# Altium project Dashcam_V2.0B.PrjPcb (part 4 of 9)

## Sheet LPDDR4.SchDoc: LPDDR4
size A2; DrawnBy: UKAYACIK; Engineer: UKAYACIK; DocumentNumber: 10; Revision: A; SheetNumber: 12; SheetTotal: 21
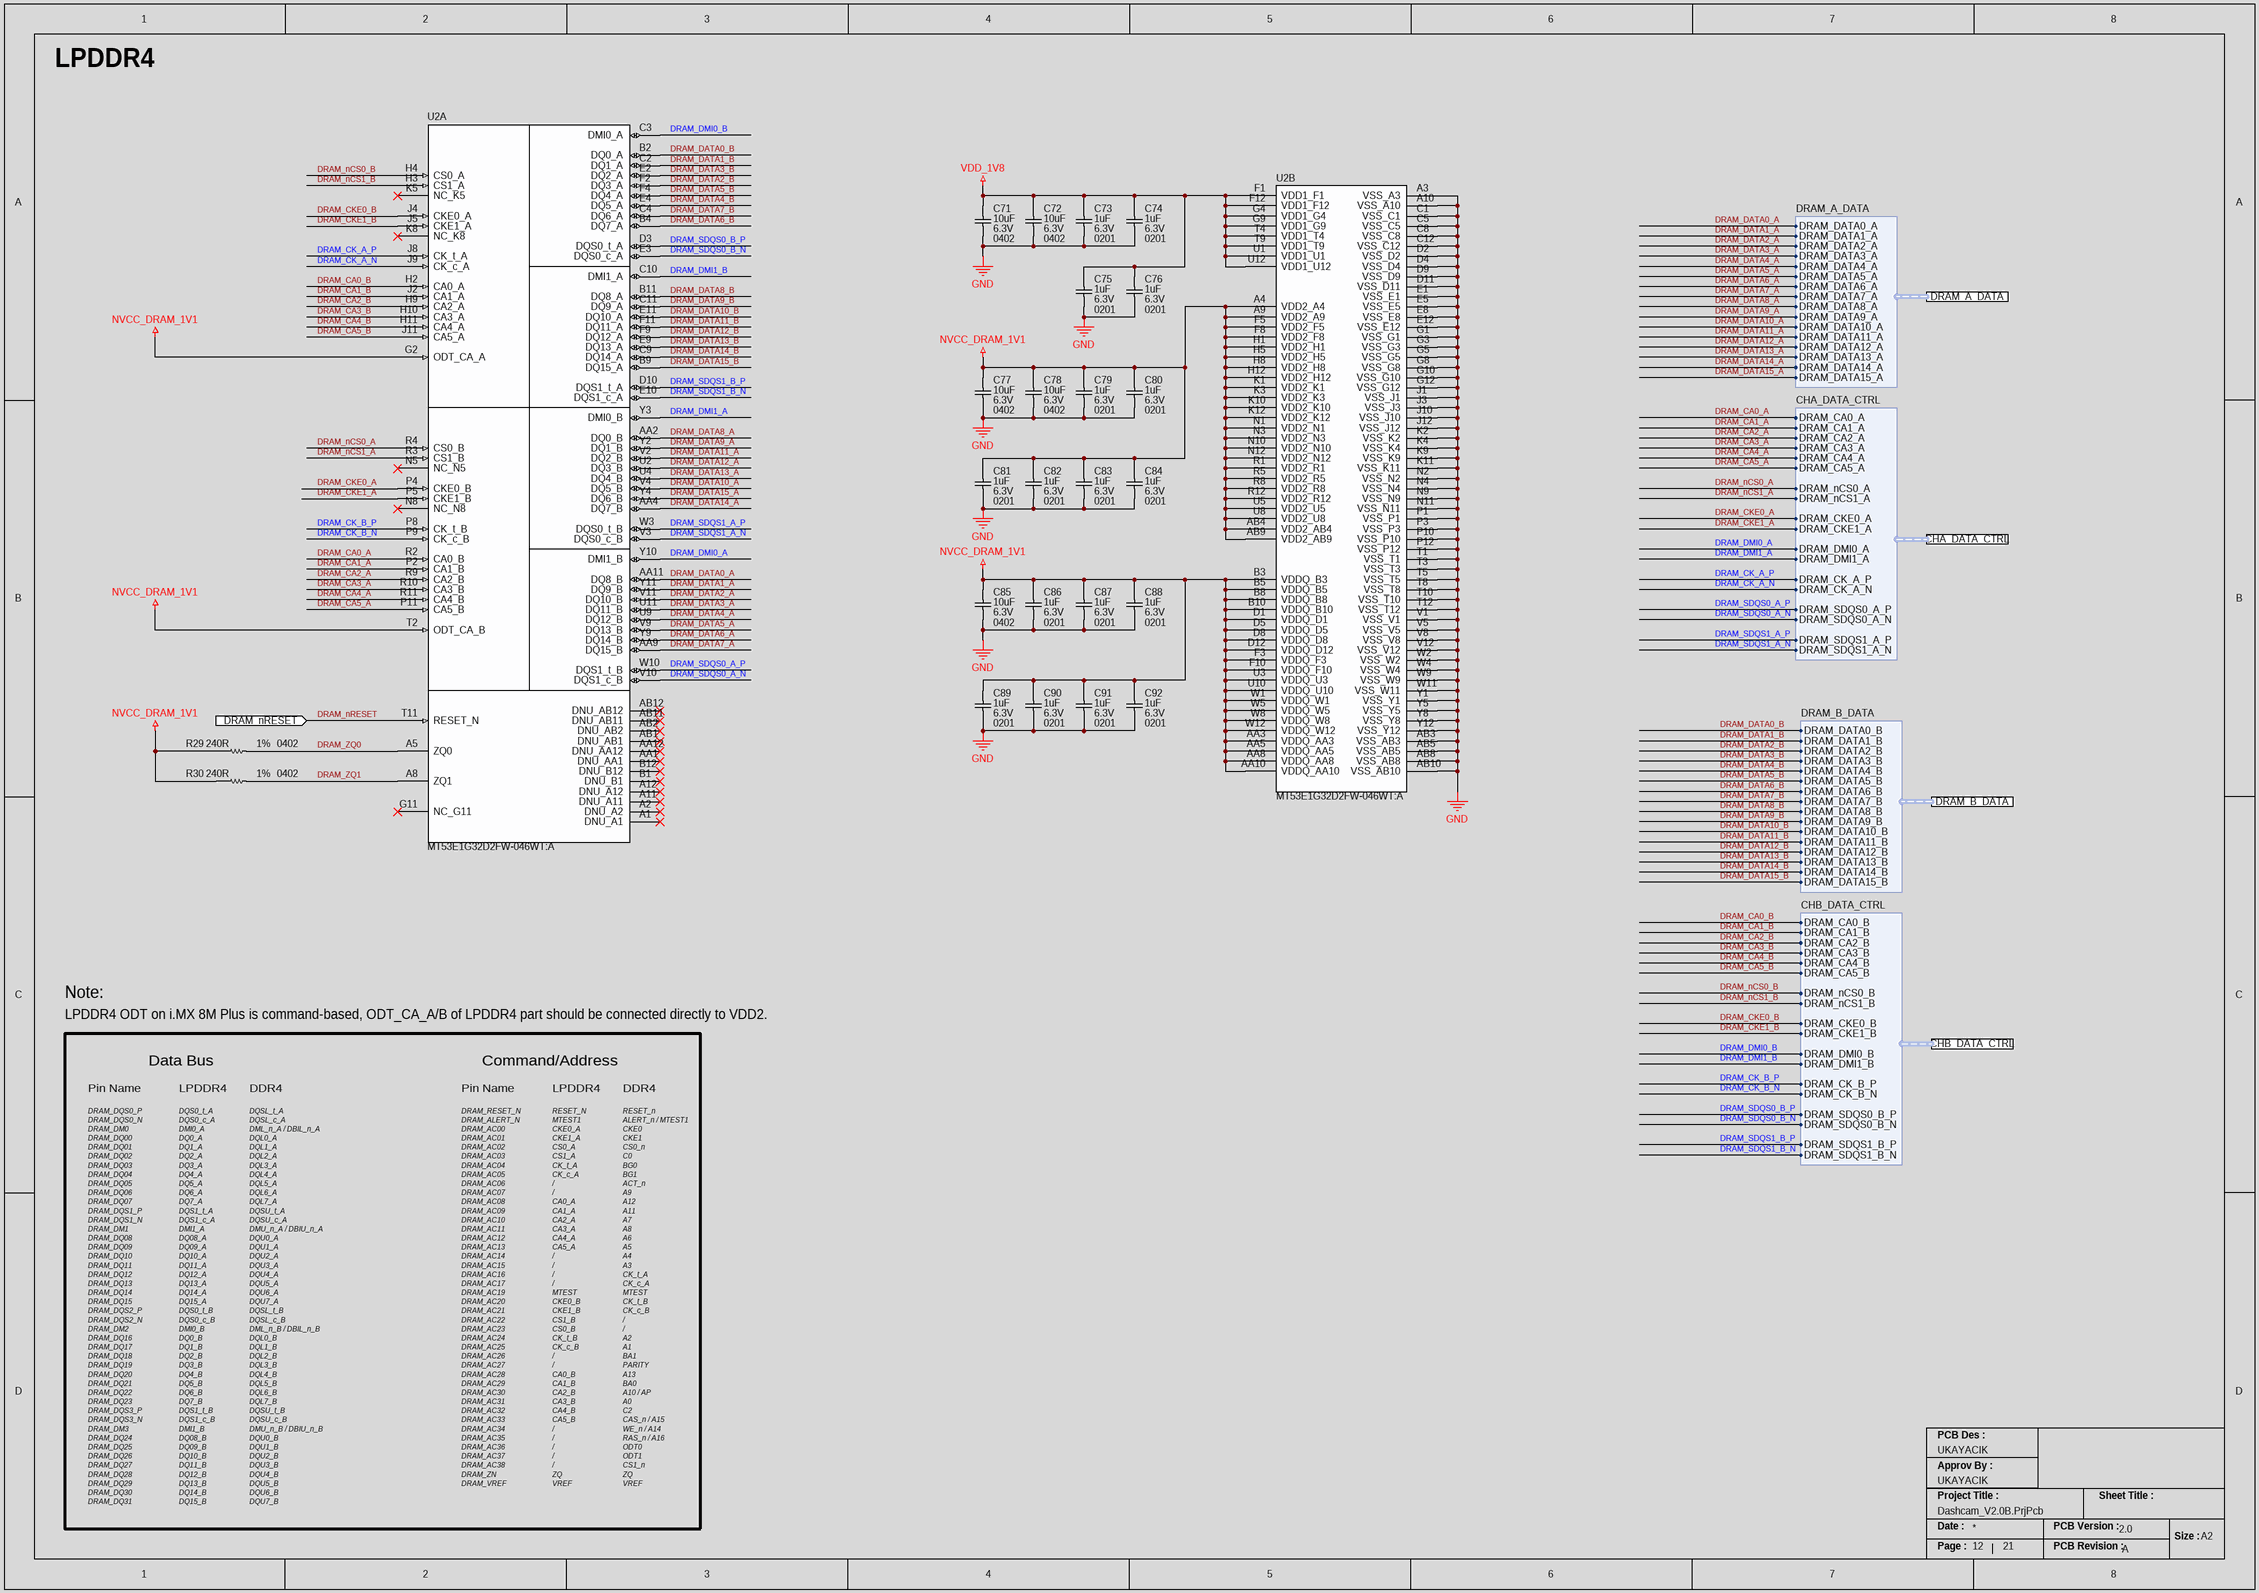
[diagram p12: LPDDR4.SchDoc]

### Parts
C71  Case/Package: 0402  Capacitance: 10uF  Voltage Rating: 6.3V  [CAP_0402_CAPC1005X05N]  (hidden comment: CL05A106MQ5NUNC)
C72  Case/Package: 0402  Capacitance: 10uF  Voltage Rating: 6.3V  [CAP_0402_CAPC1005X05N]  (hidden comment: CL05A106MQ5NUNC)
C73  Voltage Rating (DC): 6.3V  Capacitance: 1uF  Case/Package: 0201  [CAP_0201_CAPC0603X03N]  (hidden comment: 02016D105MAT2A)
C74  Voltage Rating (DC): 6.3V  Capacitance: 1uF  Case/Package: 0201  [CAP_0201_CAPC0603X03N]  (hidden comment: 02016D105MAT2A)
C75  Voltage Rating (DC): 6.3V  Capacitance: 1uF  Case/Package: 0201  [CAP_0201_CAPC0603X03N]  (hidden comment: 02016D105MAT2A)
C76  Voltage Rating (DC): 6.3V  Capacitance: 1uF  Case/Package: 0201  [CAP_0201_CAPC0603X03N]  (hidden comment: 02016D105MAT2A)
C77  Case/Package: 0402  Capacitance: 10uF  Voltage Rating: 6.3V  [CAP_0402_CAPC1005X05N]  (hidden comment: CL05A106MQ5NUNC)
C78  Case/Package: 0402  Capacitance: 10uF  Voltage Rating: 6.3V  [CAP_0402_CAPC1005X05N]  (hidden comment: CL05A106MQ5NUNC)
C79  Voltage Rating (DC): 6.3V  Capacitance: 1uF  Case/Package: 0201  [CAP_0201_CAPC0603X03N]  (hidden comment: 02016D105MAT2A)
C80  Voltage Rating (DC): 6.3V  Capacitance: 1uF  Case/Package: 0201  [CAP_0201_CAPC0603X03N]  (hidden comment: 02016D105MAT2A)
C81  Voltage Rating (DC): 6.3V  Capacitance: 1uF  Case/Package: 0201  [CAP_0201_CAPC0603X03N]  (hidden comment: 02016D105MAT2A)
C82  Voltage Rating (DC): 6.3V  Capacitance: 1uF  Case/Package: 0201  [CAP_0201_CAPC0603X03N]  (hidden comment: 02016D105MAT2A)
C83  Voltage Rating (DC): 6.3V  Capacitance: 1uF  Case/Package: 0201  [CAP_0201_CAPC0603X03N]  (hidden comment: 02016D105MAT2A)
C84  Voltage Rating (DC): 6.3V  Capacitance: 1uF  Case/Package: 0201  [CAP_0201_CAPC0603X03N]  (hidden comment: 02016D105MAT2A)
C85  Case/Package: 0402  Capacitance: 10uF  Voltage Rating: 6.3V  [CAP_0402_CAPC1005X05N]  (hidden comment: CL05A106MQ5NUNC)
C86  Voltage Rating (DC): 6.3V  Capacitance: 1uF  Case/Package: 0201  [CAP_0201_CAPC0603X03N]  (hidden comment: 02016D105MAT2A)
C87  Voltage Rating (DC): 6.3V  Capacitance: 1uF  Case/Package: 0201  [CAP_0201_CAPC0603X03N]  (hidden comment: 02016D105MAT2A)
C88  Voltage Rating (DC): 6.3V  Capacitance: 1uF  Case/Package: 0201  [CAP_0201_CAPC0603X03N]  (hidden comment: 02016D105MAT2A)
C89  Voltage Rating (DC): 6.3V  Capacitance: 1uF  Case/Package: 0201  [CAP_0201_CAPC0603X03N]  (hidden comment: 02016D105MAT2A)
C90  Voltage Rating (DC): 6.3V  Capacitance: 1uF  Case/Package: 0201  [CAP_0201_CAPC0603X03N]  (hidden comment: 02016D105MAT2A)
C91  Voltage Rating (DC): 6.3V  Capacitance: 1uF  Case/Package: 0201  [CAP_0201_CAPC0603X03N]  (hidden comment: 02016D105MAT2A)
C92  Voltage Rating (DC): 6.3V  Capacitance: 1uF  Case/Package: 0201  [CAP_0201_CAPC0603X03N]  (hidden comment: 02016D105MAT2A)
R29  Tolerance: 1%  Resistance: 240R  Case/Package: 0402  [RES_0402_RESC1005X04N]  (hidden comment: RC0402FR-07240RL)
R30  Tolerance: 1%  Resistance: 240R  Case/Package: 0402  [RES_0402_RESC1005X04N]  (hidden comment: RC0402FR-07240RL)
U2  MT53E1G32D2FW-046WT:A  [IC_DRAM_BGA200_0P65X0P8_10P1X14P6]  (parts A,B of 2)

### Ports
CHA_DATA_CTRL (harness CHA_DATA_CTRL), CHB_DATA_CTRL (harness CHB_DATA_CTRL), DRAM_A_DATA (harness DRAM_A_DATA), DRAM_B_DATA (harness DRAM_B_DATA), DRAM_nRESET (in)

### Harnesses
DRAM_A_DATA: DRAM_DATA0_A, DRAM_DATA1_A, DRAM_DATA2_A, DRAM_DATA3_A, DRAM_DATA4_A, DRAM_DATA5_A, DRAM_DATA6_A, DRAM_DATA7_A, DRAM_DATA8_A, DRAM_DATA9_A, DRAM_DATA10_A, DRAM_DATA11_A, DRAM_DATA12_A, DRAM_DATA13_A, DRAM_DATA14_A, DRAM_DATA15_A
CHA_DATA_CTRL: DRAM_CA0_A, DRAM_CA1_A, DRAM_CA2_A, DRAM_CA3_A, DRAM_CA4_A, DRAM_CA5_A, DRAM_nCS0_A, DRAM_nCS1_A, DRAM_CKE0_A, DRAM_CKE1_A, DRAM_CK_A_P, DRAM_CK_A_N, DRAM_DMI0_A, DRAM_DMI1_A, DRAM_SDQS0_A_P, DRAM_SDQS0_A_N, DRAM_SDQS1_A_P, DRAM_SDQS1_A_N
DRAM_B_DATA: DRAM_DATA0_B, DRAM_DATA1_B, DRAM_DATA2_B, DRAM_DATA3_B, DRAM_DATA4_B, DRAM_DATA5_B, DRAM_DATA6_B, DRAM_DATA7_B, DRAM_DATA8_B, DRAM_DATA9_B, DRAM_DATA10_B, DRAM_DATA11_B, DRAM_DATA12_B, DRAM_DATA13_B, DRAM_DATA14_B, DRAM_DATA15_B
CHB_DATA_CTRL: DRAM_CA0_B, DRAM_CA1_B, DRAM_CA2_B, DRAM_CA3_B, DRAM_CA4_B, DRAM_CA5_B, DRAM_nCS0_B, DRAM_nCS1_B, DRAM_CKE0_B, DRAM_CKE1_B, DRAM_CK_B_P, DRAM_CK_B_N, DRAM_DMI0_B, DRAM_DMI1_B, DRAM_SDQS0_B_P, DRAM_SDQS0_B_N, DRAM_SDQS1_B_P, DRAM_SDQS1_B_N

### Nets
GND: C71.1 C72.1 C73.1 C74.1 C75.1 C76.1 C77.1 C78.1 C79.1 C80.1 C81.1 C82.1 C83.1 C84.1 C85.1 C86.1 C87.1 C88.1 C89.1 C90.1 C91.1 C92.1 U2.A3(VSS_A3) U2.A10(VSS_A10) U2.AB3(VSS_AB3) U2.AB5(VSS_AB5) U2.AB8(VSS_AB8) U2.AB10(VSS_AB10) U2.C1(VSS_C1) U2.C5(VSS_C5) U2.C8(VSS_C8) U2.C12(VSS_C12) U2.D2(VSS_D2) U2.D4(VSS_D4) U2.D9(VSS_D9) U2.D11(VSS_D11) U2.E1(VSS_E1) U2.E5(VSS_E5) U2.E8(VSS_E8) U2.E12(VSS_E12) U2.G1(VSS_G1) U2.G3(VSS_G3) U2.G5(VSS_G5) U2.G8(VSS_G8) U2.G10(VSS_G10) U2.G12(VSS_G12) U2.J1(VSS_J1) U2.J3(VSS_J3) U2.J10(VSS_J10) U2.J12(VSS_J12) U2.K2(VSS_K2) U2.K4(VSS_K4) U2.K9(VSS_K9) U2.K11(VSS_K11) U2.N2(VSS_N2) U2.N4(VSS_N4) U2.N9(VSS_N9) U2.N11(VSS_N11) U2.P1(VSS_P1) U2.P3(VSS_P3) U2.P10(VSS_P10) U2.P12(VSS_P12) U2.T1(VSS_T1) U2.T3(VSS_T3) U2.T5(VSS_T5) U2.T8(VSS_T8) U2.T10(VSS_T10) U2.T12(VSS_T12) U2.V1(VSS_V1) U2.V5(VSS_V5) U2.V8(VSS_V8) U2.V12(VSS_V12) U2.W2(VSS_W2) U2.W4(VSS_W4) U2.W9(VSS_W9) U2.W11(VSS_W11) U2.Y1(VSS_Y1) U2.Y5(VSS_Y5) U2.Y8(VSS_Y8) U2.Y12(VSS_Y12)
NVCC_DRAM_1V1: C77.2 C78.2 C79.2 C80.2 C81.2 C82.2 C83.2 C84.2 C85.2 C86.2 C87.2 C88.2 C89.2 C90.2 C91.2 C92.2 R29.1 R30.1 U2.A4(VDD2_A4) U2.A9(VDD2_A9) U2.AA3(VDDQ_AA3) U2.AA5(VDDQ_AA5) U2.AA8(VDDQ_AA8) U2.AA10(VDDQ_AA10) U2.AB4(VDD2_AB4) U2.AB9(VDD2_AB9) U2.B3(VDDQ_B3) U2.B5(VDDQ_B5) U2.B8(VDDQ_B8) U2.B10(VDDQ_B10) U2.D1(VDDQ_D1) U2.D5(VDDQ_D5) U2.D8(VDDQ_D8) U2.D12(VDDQ_D12) U2.F3(VDDQ_F3) U2.F5(VDD2_F5) U2.F8(VDD2_F8) U2.F10(VDDQ_F10) U2.G2(ODT_CA_A) U2.H1(VDD2_H1) U2.H5(VDD2_H5) U2.H8(VDD2_H8) U2.H12(VDD2_H12) U2.K1(VDD2_K1) U2.K3(VDD2_K3) U2.K10(VDD2_K10) U2.K12(VDD2_K12) U2.N1(VDD2_N1) U2.N3(VDD2_N3) U2.N10(VDD2_N10) U2.N12(VDD2_N12) U2.R1(VDD2_R1) U2.R5(VDD2_R5) U2.R8(VDD2_R8) U2.R12(VDD2_R12) U2.T2(ODT_CA_B) U2.U3(VDDQ_U3) U2.U5(VDD2_U5) U2.U8(VDD2_U8) U2.U10(VDDQ_U10) U2.W1(VDDQ_W1) U2.W5(VDDQ_W5) U2.W8(VDDQ_W8) U2.W12(VDDQ_W12)
VDD_1V8: C71.2 C72.2 C73.2 C74.2 C75.2 C76.2 U2.F1(VDD1_F1) U2.F12(VDD1_F12) U2.G4(VDD1_G4) U2.G9(VDD1_G9) U2.T4(VDD1_T4) U2.T9(VDD1_T9) U2.U1(VDD1_U1) U2.U12(VDD1_U12)
DRAM_CA0_A: U2.R2(CA0_B) ; port CHA_DATA_CTRL.DRAM_CA0_A
DRAM_CA0_B: U2.H2(CA0_A) ; port CHB_DATA_CTRL.DRAM_CA0_B
DRAM_CA1_A: U2.P2(CA1_B) ; port CHA_DATA_CTRL.DRAM_CA1_A
DRAM_CA1_B: U2.J2(CA1_A) ; port CHB_DATA_CTRL.DRAM_CA1_B
DRAM_CA2_A: U2.R9(CA2_B) ; port CHA_DATA_CTRL.DRAM_CA2_A
DRAM_CA2_B: U2.H9(CA2_A) ; port CHB_DATA_CTRL.DRAM_CA2_B
DRAM_CA3_A: U2.R10(CA3_B) ; port CHA_DATA_CTRL.DRAM_CA3_A
DRAM_CA3_B: U2.H10(CA3_A) ; port CHB_DATA_CTRL.DRAM_CA3_B
DRAM_CA4_A: U2.R11(CA4_B) ; port CHA_DATA_CTRL.DRAM_CA4_A
DRAM_CA4_B: U2.H11(CA4_A) ; port CHB_DATA_CTRL.DRAM_CA4_B
DRAM_CA5_A: U2.P11(CA5_B) ; port CHA_DATA_CTRL.DRAM_CA5_A
DRAM_CA5_B: U2.J11(CA5_A) ; port CHB_DATA_CTRL.DRAM_CA5_B
DRAM_CK_A_N: U2.J9(CK_c_A) ; port CHA_DATA_CTRL.DRAM_CK_A_N
DRAM_CK_A_P: U2.J8(CK_t_A) ; port CHA_DATA_CTRL.DRAM_CK_A_P
DRAM_CK_B_N: U2.P9(CK_c_B) ; port CHB_DATA_CTRL.DRAM_CK_B_N
DRAM_CK_B_P: U2.P8(CK_t_B) ; port CHB_DATA_CTRL.DRAM_CK_B_P
DRAM_CKE0_A: U2.P4(CKE0_B) ; port CHA_DATA_CTRL.DRAM_CKE0_A
DRAM_CKE0_B: U2.J4(CKE0_A) ; port CHB_DATA_CTRL.DRAM_CKE0_B
DRAM_CKE1_A: U2.P5(CKE1_B) ; port CHA_DATA_CTRL.DRAM_CKE1_A
DRAM_CKE1_B: U2.J5(CKE1_A) ; port CHB_DATA_CTRL.DRAM_CKE1_B
DRAM_DATA0_A: U2.AA11(DQ8_B) ; port DRAM_A_DATA.DRAM_DATA0_A
DRAM_DATA0_B: U2.B2(DQ0_A) ; port DRAM_B_DATA.DRAM_DATA0_B
DRAM_DATA1_A: U2.Y11(DQ9_B) ; port DRAM_A_DATA.DRAM_DATA1_A
DRAM_DATA1_B: U2.C2(DQ1_A) ; port DRAM_B_DATA.DRAM_DATA1_B
DRAM_DATA2_A: U2.V11(DQ10_B) ; port DRAM_A_DATA.DRAM_DATA2_A
DRAM_DATA2_B: U2.F2(DQ3_A) ; port DRAM_B_DATA.DRAM_DATA2_B
DRAM_DATA3_A: U2.U11(DQ11_B) ; port DRAM_A_DATA.DRAM_DATA3_A
DRAM_DATA3_B: U2.E2(DQ2_A) ; port DRAM_B_DATA.DRAM_DATA3_B
DRAM_DATA4_A: U2.U9(DQ12_B) ; port DRAM_A_DATA.DRAM_DATA4_A
DRAM_DATA4_B: U2.E4(DQ5_A) ; port DRAM_B_DATA.DRAM_DATA4_B
DRAM_DATA5_A: U2.V9(DQ13_B) ; port DRAM_A_DATA.DRAM_DATA5_A
DRAM_DATA5_B: U2.F4(DQ4_A) ; port DRAM_B_DATA.DRAM_DATA5_B
DRAM_DATA6_A: U2.Y9(DQ14_B) ; port DRAM_A_DATA.DRAM_DATA6_A
DRAM_DATA6_B: U2.B4(DQ7_A) ; port DRAM_B_DATA.DRAM_DATA6_B
DRAM_DATA7_A: U2.AA9(DQ15_B) ; port DRAM_A_DATA.DRAM_DATA7_A
DRAM_DATA7_B: U2.C4(DQ6_A) ; port DRAM_B_DATA.DRAM_DATA7_B
DRAM_DATA8_A: U2.AA2(DQ0_B) ; port DRAM_A_DATA.DRAM_DATA8_A
DRAM_DATA8_B: U2.B11(DQ8_A) ; port DRAM_B_DATA.DRAM_DATA8_B
DRAM_DATA9_A: U2.Y2(DQ1_B) ; port DRAM_A_DATA.DRAM_DATA9_A
DRAM_DATA9_B: U2.C11(DQ9_A) ; port DRAM_B_DATA.DRAM_DATA9_B
DRAM_DATA10_A: U2.V4(DQ5_B) ; port DRAM_A_DATA.DRAM_DATA10_A
DRAM_DATA10_B: U2.E11(DQ10_A) ; port DRAM_B_DATA.DRAM_DATA10_B
DRAM_DATA11_A: U2.V2(DQ2_B) ; port DRAM_A_DATA.DRAM_DATA11_A
DRAM_DATA11_B: U2.F11(DQ11_A) ; port DRAM_B_DATA.DRAM_DATA11_B
DRAM_DATA12_A: U2.U2(DQ3_B) ; port DRAM_A_DATA.DRAM_DATA12_A
DRAM_DATA12_B: U2.F9(DQ12_A) ; port DRAM_B_DATA.DRAM_DATA12_B
DRAM_DATA13_A: U2.U4(DQ4_B) ; port DRAM_A_DATA.DRAM_DATA13_A
DRAM_DATA13_B: U2.E9(DQ13_A) ; port DRAM_B_DATA.DRAM_DATA13_B
DRAM_DATA14_A: U2.AA4(DQ7_B) ; port DRAM_A_DATA.DRAM_DATA14_A
DRAM_DATA14_B: U2.C9(DQ14_A) ; port DRAM_B_DATA.DRAM_DATA14_B
DRAM_DATA15_A: U2.Y4(DQ6_B) ; port DRAM_A_DATA.DRAM_DATA15_A
DRAM_DATA15_B: U2.B9(DQ15_A) ; port DRAM_B_DATA.DRAM_DATA15_B
DRAM_DMI0_A: U2.Y10(DMI1_B) ; port CHA_DATA_CTRL.DRAM_DMI0_A
DRAM_DMI0_B: U2.C3(DMI0_A) ; port CHB_DATA_CTRL.DRAM_DMI0_B
DRAM_DMI1_A: U2.Y3(DMI0_B) ; port CHA_DATA_CTRL.DRAM_DMI1_A
DRAM_DMI1_B: U2.C10(DMI1_A) ; port CHB_DATA_CTRL.DRAM_DMI1_B
DRAM_nCS0_A: U2.R4(CS0_B) ; port CHA_DATA_CTRL.DRAM_nCS0_A
DRAM_nCS0_B: U2.H4(CS0_A) ; port CHB_DATA_CTRL.DRAM_nCS0_B
DRAM_nCS1_A: U2.R3(CS1_B) ; port CHA_DATA_CTRL.DRAM_nCS1_A
DRAM_nCS1_B: U2.H3(CS1_A) ; port CHB_DATA_CTRL.DRAM_nCS1_B
DRAM_nRESET: U2.T11(RESET_N) ; port DRAM_nRESET
DRAM_SDQS0_A_N: U2.V10(DQS1_c_B) ; port CHA_DATA_CTRL.DRAM_SDQS0_A_N
DRAM_SDQS0_A_P: U2.W10(DQS1_t_B) ; port CHA_DATA_CTRL.DRAM_SDQS0_A_P
DRAM_SDQS0_B_N: U2.E3(DQS0_c_A) ; port CHB_DATA_CTRL.DRAM_SDQS0_B_N
DRAM_SDQS0_B_P: U2.D3(DQS0_t_A) ; port CHB_DATA_CTRL.DRAM_SDQS0_B_P
DRAM_SDQS1_A_N: U2.V3(DQS0_c_B) ; port CHA_DATA_CTRL.DRAM_SDQS1_A_N
DRAM_SDQS1_A_P: U2.W3(DQS0_t_B) ; port CHA_DATA_CTRL.DRAM_SDQS1_A_P
DRAM_SDQS1_B_N: U2.E10(DQS1_c_A) ; port CHB_DATA_CTRL.DRAM_SDQS1_B_N
DRAM_SDQS1_B_P: U2.D10(DQS1_t_A) ; port CHB_DATA_CTRL.DRAM_SDQS1_B_P
DRAM_ZQ0: R29.2 U2.A5(ZQ0)
DRAM_ZQ1: R30.2 U2.A8(ZQ1)

Not connected (* = marked no-connect by the designer): U2 A1(DNU_A1)* A2(DNU_A2)* A11(DNU_A11)* A12(DNU_A12)* AA1(DNU_AA1)* AA12(DNU_AA12)* AB1(DNU_AB1)* AB2(DNU_AB2)* AB11(DNU_AB11)* AB12(DNU_AB12)* B1(DNU_B1)* B12(DNU_B12)* G11(NC_G11)* K5(NC_K5)* K8(NC_K8)* N5(NC_N5)* N8(NC_N8)*

### Notes on the sheet
- LPDDR4
- Note:
- LPDDR4 ODT on i.MX 8M Plus is command-based, ODT_CA_A/B of LPDDR4 part should be connected directly to VDD2.
- Pin Name
- Data Bus
- DDR4
- Command/Address
- DRAM_DQS0_P
  DRAM_DQS0_N
  DRAM_DM0
  DRAM_DQ00
  DRAM_DQ01
  DRAM_DQ02
  DRAM_DQ03
  DRAM_DQ04
  DRAM_DQ05
  DRAM_DQ06
  DRAM_DQ07
  DRAM_DQS1_P
  DRAM_DQS1_N
  DRAM_DM1
  DRAM_DQ08
  DRAM_DQ09
  DRAM_DQ10
  DRAM_DQ11
  DRAM_DQ12
  DRAM_DQ13
  DRAM_DQ14
  DRAM_DQ15
  DRAM_DQS2_P
  DRAM_DQS2_N
  DRAM_DM2
  DRAM_DQ16
  DRAM_DQ17
  DRAM_DQ18
  DRAM_DQ19
  DRAM_DQ20
  DRAM_DQ21
  DRAM_DQ22
  DRAM_DQ23
  DRAM_DQS3_P
  DRAM_DQS3_N
  DRAM_DM3
  DRAM_DQ24
  DRAM_DQ25
  DRAM_DQ26
  DRAM_DQ27
  DRAM_DQ28
  DRAM_DQ29
  DRAM_DQ30
  DRAM_DQ31
- DQS0_t_A
  DQS0_c_A
  DMI0_A
  DQ0_A
  DQ1_A
  DQ2_A
  DQ3_A
  DQ4_A
  DQ5_A
  DQ6_A
  DQ7_A
  DQS1_t_A
  DQS1_c_A
  DMI1_A
  DQ08_A
  DQ09_A
  DQ10_A
  DQ11_A
  DQ12_A
  DQ13_A
  DQ14_A
  DQ15_A
  DQS0_t_B
  DQS0_c_B
  DMI0_B
  DQ0_B
  DQ1_B
  DQ2_B
  DQ3_B
  DQ4_B
  DQ5_B
  DQ6_B
  DQ7_B
  DQS1_t_B
  DQS1_c_B
  DMI1_B
  DQ08_B
  DQ09_B
  DQ10_B
  DQ11_B
  DQ12_B
  DQ13_B
  DQ14_B
  DQ15_B
- DQSL_t_A
  DQSL_c_A
  DML_n_A / DBIL_n_A
  DQL0_A
  DQL1_A
  DQL2_A
  DQL3_A
  DQL4_A
  DQL5_A
  DQL6_A
  DQL7_A
  DQSU_t_A
  DQSU_c_A
  DMU_n_A / DBIU_n_A
  DQU0_A
  DQU1_A
  DQU2_A
  DQU3_A
  DQU4_A
  DQU5_A
  DQU6_A
  DQU7_A
  DQSL_t_B
  DQSL_c_B
  DML_n_B / DBIL_n_B
  DQL0_B
  DQL1_B
  DQL2_B
  DQL3_B
  DQL4_B
  DQL5_B
  DQL6_B
  DQL7_B
  DQSU_t_B
  DQSU_c_B
  DMU_n_B / DBIU_n_B
  DQU0_B
  DQU1_B
  DQU2_B
  DQU3_B
  DQU4_B
  DQU5_B
  DQU6_B
  DQU7_B
- DRAM_RESET_N
  DRAM_ALERT_N
  DRAM_AC00
  DRAM_AC01
  DRAM_AC02
  DRAM_AC03
  DRAM_AC04
  DRAM_AC05
  DRAM_AC06
  DRAM_AC07
  DRAM_AC08
  DRAM_AC09
  DRAM_AC10
  DRAM_AC11
  DRAM_AC12
  DRAM_AC13
  DRAM_AC14
  DRAM_AC15
  DRAM_AC16
  DRAM_AC17
  DRAM_AC19
  DRAM_AC20
  DRAM_AC21
  DRAM_AC22
  DRAM_AC23
  DRAM_AC24
  DRAM_AC25
  DRAM_AC26
  DRAM_AC27
  DRAM_AC28
  DRAM_AC29
  DRAM_AC30
  DRAM_AC31
  DRAM_AC32
  DRAM_AC33
  DRAM_AC34
  DRAM_AC35
  DRAM_AC36
  DRAM_AC37
  DRAM_AC38
  DRAM_ZN
  DRAM_VREF
- RESET_N
  MTEST1
  CKE0_A
  CKE1_A
  CS0_A
  CS1_A
  CK_t_A
  CK_c_A
  /
  /
  CA0_A
  CA1_A
  CA2_A
  CA3_A
  CA4_A
  CA5_A
  /
  /
  /
  /
  MTEST
  CKE0_B
  CKE1_B
  CS1_B
  CS0_B
  CK_t_B
  CK_c_B
  /
  /
  CA0_B
  CA1_B
  CA2_B
  CA3_B
  CA4_B
  CA5_B
  /
  /
  /
  /
  /
  ZQ
  VREF
- RESET_n
  ALERT_n / MTEST1
  CKE0
  CKE1
  CS0_n
  C0
  BG0
  BG1
  ACT_n
  A9
  A12
  A11
  A7
  A8
  A6
  A5
  A4
  A3
  CK_t_A
  CK_c_A
  MTEST
  CK_t_B
  CK_c_B
  /
  /
  A2
  A1
  BA1
  PARITY
  A13
  BA0
  A10 / AP
  A0
  C2
  CAS_n / A15
  WE_n / A14
  RAS_n / A16
  ODT0
  ODT1
  CS1_n
  ZQ
  VREF
- PCB Des :
- Approv By :
- Project Title :
- Sheet Title :
- Date :
- Page :
- PCB Version :
- PCB Revision :
- Size :
- A2

### Library data of the parts
C71 C72 C77 C78 C85 = CAP_10UF_6.3V_X5R_0402: as C1 on sheet CPU Power; Supplier 1: Digikey; Manufacturer Part Number: CL05A106MQ5NUNC; RoHS: Yes; Category: Ceramic Capacitors; Stock 1: 6097180; Pricing 1: 1=0.24, 10=0.153, 50=0.0968, 100=0.0774, 500=0.05588, 1000=0.04943, 2500=0.04728, 5000=0.04299 (USD); Mount: Surface Mount; Case Code (Metric): 1005; Case Code (Imperial): 0402; Min Operating Temperature: -55°C; Max Operating Temperature: 85°C; Packaging: Tape and Reel; Tolerance: 20%; Dielectric: X5R; Series: CL; Package Quantity: 1; Construction: Flat; Length: 1mm; Width: 0.02inch; Height: 0.5mm; Depth: 0.5mm; Thickness: 0.028inch; Radiation Hardening: No; RoHS Compliant: Yes; ComponentLink1URL: https://datasheet.ciiva.com/16437/cl05a106mq5nunc-16437356.pdf?src-supplier=Future+Electronics; ComponentLink1Description: https://datasheet.ciiva.com/16437/cl05a106mq5nunc-16437356.pdf?src-supplier=Future+Electronics; ComponentLink2URL: https://datasheet.ciiva.com/26877/getdatasheetpartid-355289-26877841.pdf?src-supplier=Verical; ComponentLink2Description: https://datasheet.ciiva.com/26877/getdatasheetpartid-355289-26877841.pdf?src-supplier=Verical; Supplier Part Number 1: 1276-1451-1-ND
C73-C76 C79-C84 C86-C92 = CAP_1UF_6.3V_X5R_0201: as C2 on sheet CPU Power; Supplier 1: Mouser; Manufacturer Part Number: 02016D105MAT2A; RoHS: Yes; Category: Ceramic Capacitors; Stock 1: 1026413; Pricing 1: 1=0.1, 10=0.028, 50=0.028, 100=0.014, 1000=0.008, 10000=0.006 (USD); Mount: Surface Mount; Number of Pins: 2; Case Code (Metric): 0603; Case Code (Imperial): 0201; Min Operating Temperature: -55°C; Max Operating Temperature: 85°C; Packaging: Cut Tape; Series: -; Voltage Rating: 6.3V; Package Quantity: 1; Length: 0.024inch; Width: 0.012inch; Thickness: 0.013inch; Depth: 0.3mm; Lead Free: Lead Free; RoHS Compliant: Yes; Reach SVHC Compliant: No; ComponentLink1URL: https://datasheet.ciiva.com/6265/cx5r-6265595.pdf?src-supplier=Digi-Key; ComponentLink1Description: https://datasheet.ciiva.com/6265/cx5r-6265595.pdf?src-supplier=Digi-Key; ComponentLink2URL: https://datasheet.ciiva.com/1123/1666675-1123122.pdf?src-supplier=Element14; ComponentLink2Description: https://datasheet.ciiva.com/1123/1666675-1123122.pdf?src-supplier=Element14; ComponentLink3URL: https://datasheet.ciiva.com/14891/cx5r-14891029.pdf?src-supplier=Digi-Key; ComponentLink3Description: https://datasheet.ciiva.com/14891/cx5r-14891029.pdf?src-supplier=Digi-Key; ComponentLink4URL: https://datasheet.ciiva.com/7614/cx5r-7614682.pdf?src-supplier=Digi-Key; ComponentLink4Description: https://datasheet.ciiva.com/7614/cx5r-7614682.pdf?src-supplier=Digi-Key; ComponentLink5URL: https://datasheet.ciiva.com/14891/cx5r-14891030.pdf?src-supplier=Digi-Key; ComponentLink5Description: https://datasheet.ciiva.com/14891/cx5r-14891030.pdf?src-supplier=Digi-Key; Supplier Part Number 1: 581-02016D105MAT2A; Dielectric: X5R
R29 R30 = RES_240R_1%_63mW_0402: SMD Chip Resistor, 240 Ohm, ± 1%, 63 mW, 0402 [1005 Metric], Thick Film, General Purpose; Manufacturer: Yageo; Power Rating: 63mW; Voltage Rating: 50V; Temperature Coefficient: 100ppm/°C; Supplier 1: Digi-Key; Manufacturer Part Number: RC0402FR-07240RL; RoHS: Yes; Category: Chip SMD Resistors; Stock 1: 1880273; Pricing 1: 1=0.1, 10=0.014, 50=0.0084, 100=0.007, 500=0.00464, 1000=0.00396, 5000=0.00282 (USD); Case Code (Metric): 1005; Case Code (Imperial): 0402; Size Code: 0402; Min Operating Temperature: -55°C; Max Operating Temperature: 155°C; Resistor Type: Thick Film; Packaging: Tape and Reel; Number of Terminations: 2; Termination: SMD/SMT; Max Power Dissipation: 63mW; Voltage Rating (DC): 50V; Features: Moisture Resistant; Series: RC; Construction: Rectangular; Resistance Tolerance: 1%; Length: 1mm; Depth: 0.5mm; RoHS Compliant: Yes; Military Standard: Not; Lead Free: Lead Free; Reach SVHC Compliant: Unknown; ComponentLink1URL: https://datasheet.ciiva.com/7849/1018594-7849915.pdf?src-supplier=Element14; ComponentLink1Description: https://datasheet.ciiva.com/7849/1018594-7849915.pdf?src-supplier=Element14; ComponentLink2URL: https://datasheet.ciiva.com/7849/1018594-7849916.pdf?src-supplier=Element14; ComponentLink2Description: https://datasheet.ciiva.com/7849/1018594-7849916.pdf?src-supplier=Element14; ComponentLink3URL: https://datasheet.ciiva.com/2519/pyu-r-int-thick-7-2519158.pdf?src-supplier=Digi-Key; ComponentLink3Description: https://datasheet.ciiva.com/2519/pyu-r-int-thick-7-2519158.pdf?src-supplier=Digi-Key; ComponentLink4URL: https://datasheet.ciiva.com/2519/pyu-r-int-thick-7-2519157.pdf?src-supplier=Digi-Key; ComponentLink4Description: https://datasheet.ciiva.com/2519/pyu-r-int-thick-7-2519157.pdf?src-supplier=Digi-Key; ComponentLink5URL: https://datasheet.ciiva.com/2519/pyu-r-int-thick-7-2519156.pdf?src-supplier=Digi-Key; ComponentLink5Description: https://datasheet.ciiva.com/2519/pyu-r-int-thick-7-2519156.pdf?src-supplier=Digi-Key; ComponentLink6URL: https://datasheet.ciiva.com/12669/pyu-rc0402-51-rohs-l-6-r-12669689.pdf?src-supplier=Mouser; ComponentLink6Description: https://datasheet.ciiva.com/12669/pyu-rc0402-51-rohs-l-6-r-12669689.pdf?src-supplier=Mouser; ComponentLink7URL: https://datasheet.ciiva.com/17419/pyu-rc0402-51-rohs-l-6-r-17419482.pdf?src-supplier=Future+Electronics; ComponentLink7Description: https://datasheet.ciiva.com/17419/pyu-rc0402-51-rohs-l-6-r-17419482.pdf?src-supplier=Future+Electronics; Supplier Part Number 1: 311-240LRCT-ND
U2 = IC_DRAM_32G_MT53E1G32D2FW-046WT:A: LPDDR4 32G 1GX32 FBGA DDP; Manufacturer: Micron Technology; Supplier 1: Digikey; Manufacturer Part Number: MT53E1G32D2FW-046WT:A; RoHS: No; Stock 1: 1349; Pricing 1: 1=26.73, 10=24.892, 25=24.6252, 50=24.0178, 100=21.0842, 250=20.37296, 500=19.82474 (USD); Supplier Part Number 1: 557-MT53E1G32D2FW-046WT:A-ND

## Sheet eMMC FLASH.SchDoc: eMMC
size A3; DrawnBy: UKAYACIK; Engineer: UKAYACIK; DocumentNumber: 11; Revision: A; SheetNumber: 13; SheetTotal: 21
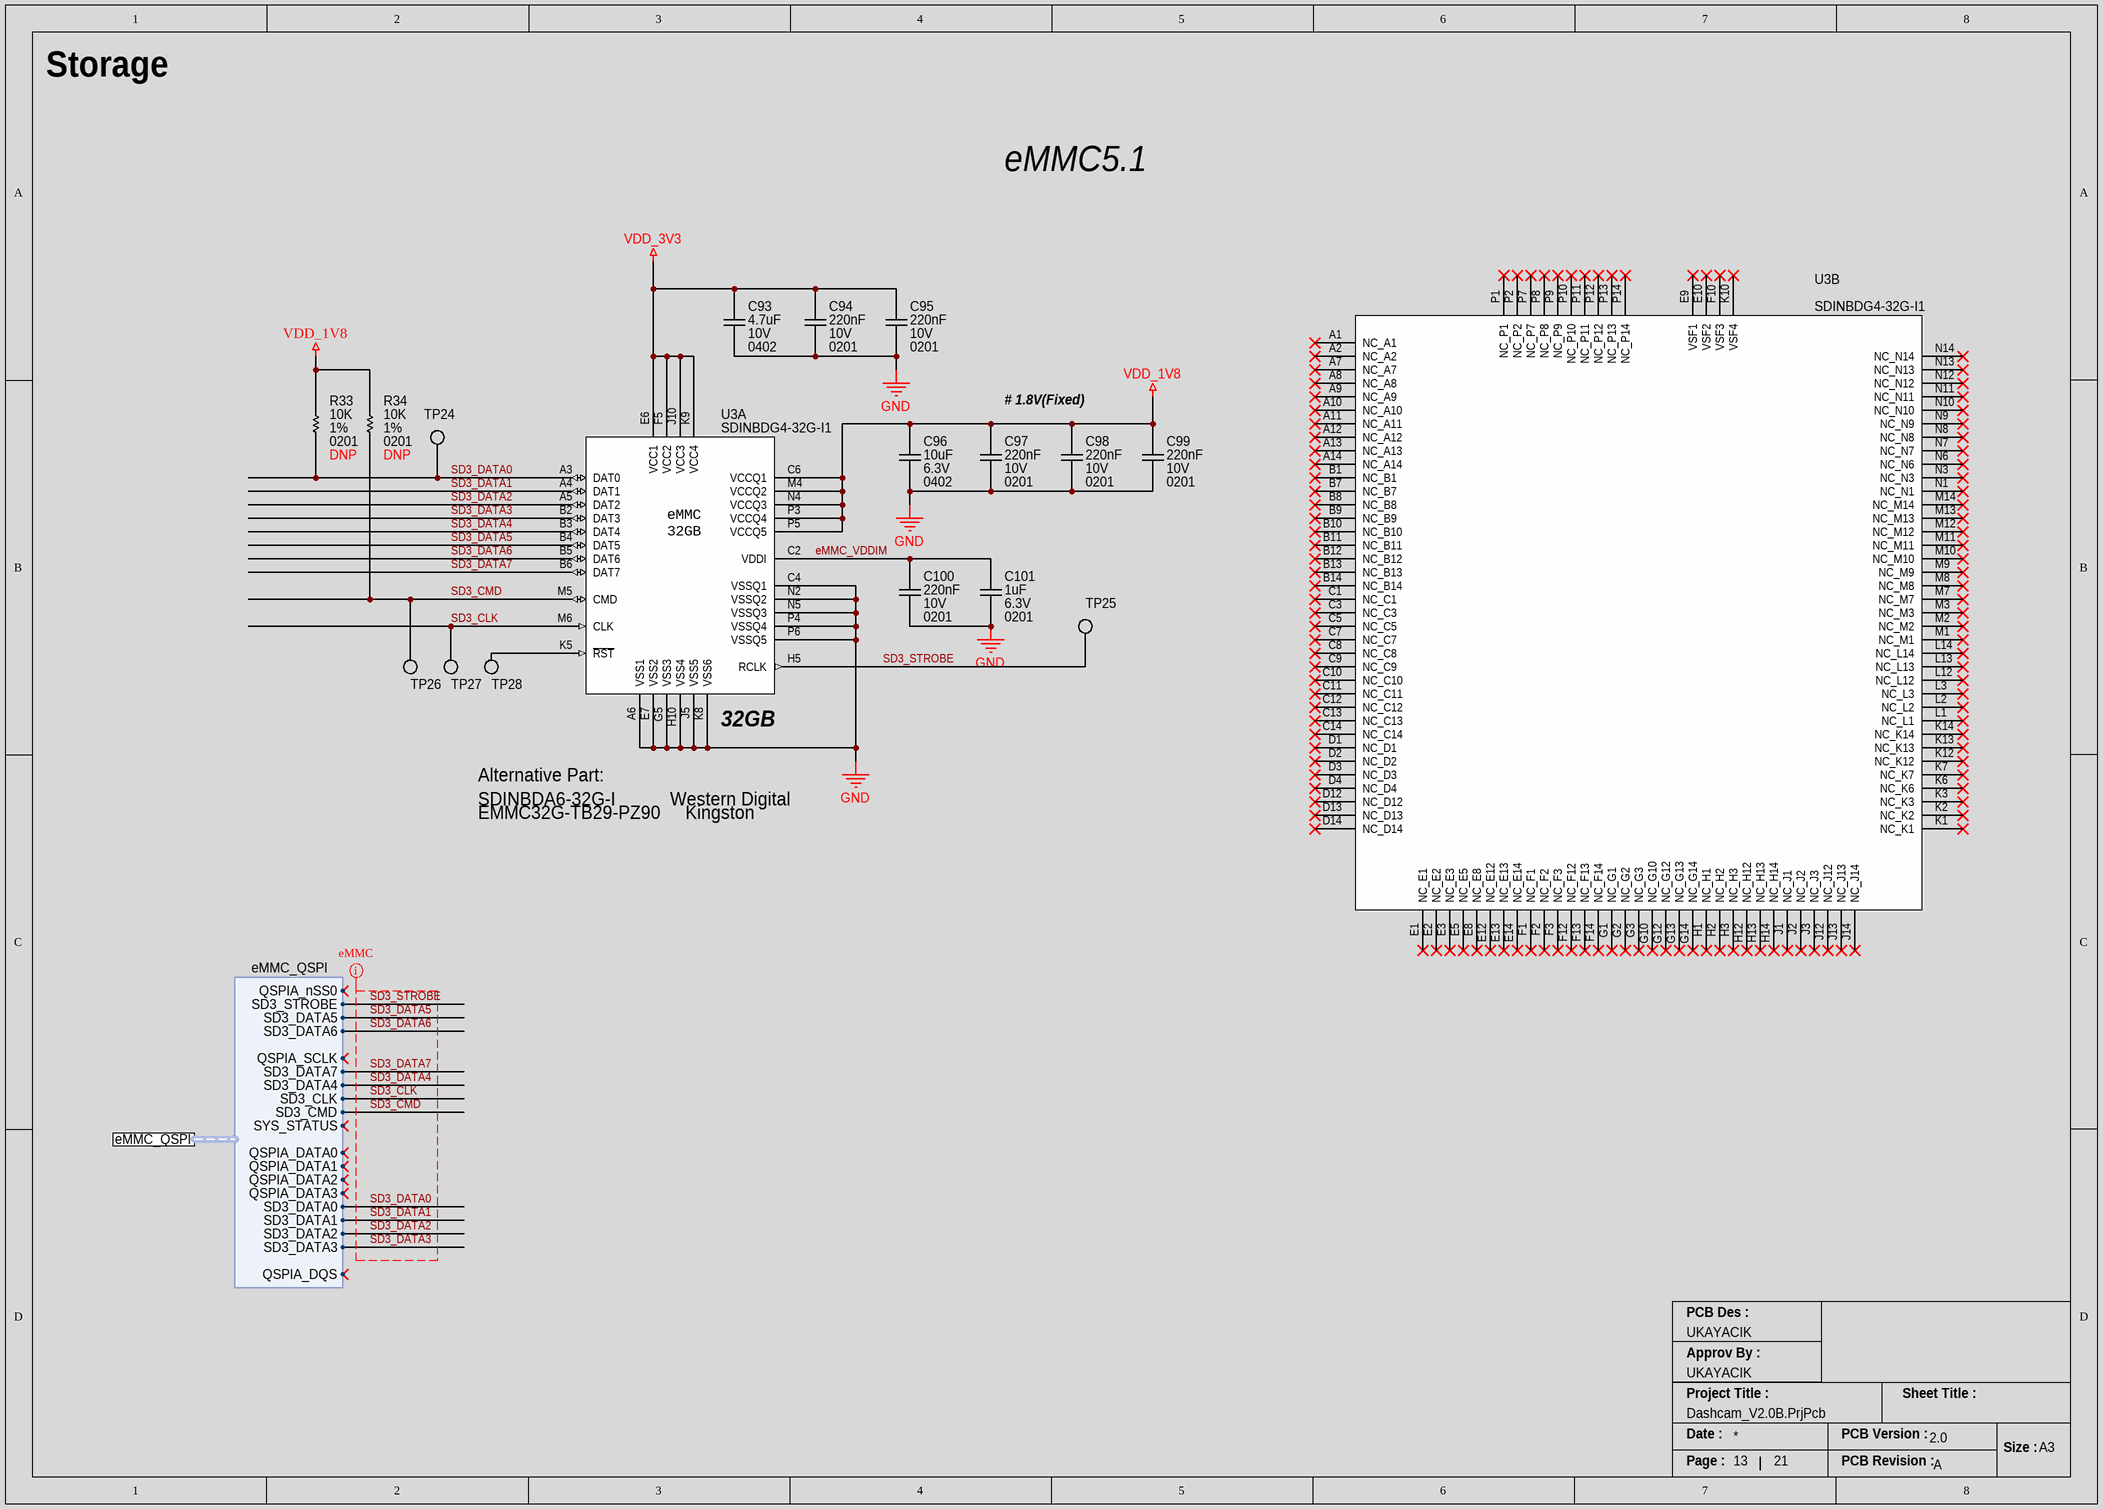
[diagram p13: eMMC FLASH.SchDoc]

### Parts
C93  Capacitance: 4.7uF  Voltage Rating: 10V  Case/Package: 0402  [CAP_0402_CAPC1005X05N]  (hidden comment: CL05A475KP5NRNC)
C94  Voltage Rating (DC): 10V  Capacitance: 220nF  Case/Package: 0201  [CAP_0201_CAPC0603X03N]  (hidden comment: LMK063BJ224MP-F)
C95  Voltage Rating (DC): 10V  Capacitance: 220nF  Case/Package: 0201  [CAP_0201_CAPC0603X03N]  (hidden comment: LMK063BJ224MP-F)
C96  Case/Package: 0402  Capacitance: 10uF  Voltage Rating: 6.3V  [CAP_0402_CAPC1005X05N]  (hidden comment: CL05A106MQ5NUNC)
C97  Voltage Rating (DC): 10V  Capacitance: 220nF  Case/Package: 0201  [CAP_0201_CAPC0603X03N]  (hidden comment: LMK063BJ224MP-F)
C98  Voltage Rating (DC): 10V  Capacitance: 220nF  Case/Package: 0201  [CAP_0201_CAPC0603X03N]  (hidden comment: LMK063BJ224MP-F)
C99  Voltage Rating (DC): 10V  Capacitance: 220nF  Case/Package: 0201  [CAP_0201_CAPC0603X03N]  (hidden comment: LMK063BJ224MP-F)
C100  Voltage Rating (DC): 10V  Capacitance: 220nF  Case/Package: 0201  [CAP_0201_CAPC0603X03N]  (hidden comment: LMK063BJ224MP-F)
C101  Voltage Rating (DC): 6.3V  Capacitance: 1uF  Case/Package: 0201  [CAP_0201_CAPC0603X03N]  (hidden comment: 02016D105MAT2A)
R33  Tolerance: 1%  Resistance: 10K  Case Code (Imperial): 0201  [RES_0201_RESC0603X02N]  (hidden comment: RC0201FR-0710KL)
R34  Tolerance: 1%  Resistance: 10K  Case Code (Imperial): 0201  [RES_0201_RESC0603X02N]  (hidden comment: RC0201FR-0710KL)
TP24  NO COMPONENT  [TP_PAD_0.5MM_SMD_ROUND]  (value not drawn)  (no BOM)
TP25  NO COMPONENT  [TP_PAD_0.5MM_SMD_ROUND]  (value not drawn)  (no BOM)
TP26  NO COMPONENT  [TP_PAD_0.5MM_SMD_ROUND]  (value not drawn)  (no BOM)
TP27  NO COMPONENT  [TP_PAD_0.5MM_SMD_ROUND]  (value not drawn)  (no BOM)
TP28  NO COMPONENT  [TP_PAD_0.5MM_SMD_ROUND]  (value not drawn)  (no BOM)
U3  SDINBDG4-32G-I1  [IC_MEMORY_eMMC]  (parts A,B of 2)

### Ports
eMMC_QSPI (harness eMMC_QSPI)

### Harnesses
eMMC_QSPI: SD3_STROBE, SD3_DATA5, SD3_DATA6, SD3_DATA7, SD3_DATA4, SD3_CLK, SD3_CMD, SYS_STATUS, QSPIA_DATA0, QSPIA_DATA1, QSPIA_DATA2, QSPIA_DATA3, QSPIA_nSS0, SD3_DATA0, QSPIA_SCLK, SD3_DATA1, SD3_DATA2, SD3_DATA3, QSPIA_DQS

### Nets
GND: C93.1 C94.1 C95.1 C96.1 C97.1 C98.1 C99.1 C100.1 C101.1 U3.A6(VSS1) U3.C4(VSSQ1) U3.E7(VSS2) U3.G5(VSS3) U3.H10(VSS4) U3.J5(VSS5) U3.K8(VSS6) U3.N2(VSSQ2) U3.N5(VSSQ3) U3.P4(VSSQ4) U3.P6(VSSQ5)
VDD_1V8: C96.2 C97.2 C98.2 C99.2 R33.2 R34.2 U3.C6(VCCQ1) U3.M4(VCCQ2) U3.N4(VCCQ3) U3.P3(VCCQ4) U3.P5(VCCQ5)
VDD_3V3: C93.2 C94.2 C95.2 U3.E6(VCC1) U3.F5(VCC2) U3.J10(VCC3) U3.K9(VCC4)
eMMC_VDDIM: C100.2 C101.2 U3.C2(VDDI)
SD3_CLK: TP27.1 U3.M6(CLK) ; port eMMC_QSPI.SD3_CLK
SD3_CMD: R34.1 TP26.1 U3.M5(CMD) ; port eMMC_QSPI.SD3_CMD
SD3_DATA0: R33.1 TP24.1 U3.A3(DAT0) ; port eMMC_QSPI.SD3_DATA0
SD3_DATA1: U3.A4(DAT1) ; port eMMC_QSPI.SD3_DATA1
SD3_DATA2: U3.A5(DAT2) ; port eMMC_QSPI.SD3_DATA2
SD3_DATA3: U3.B2(DAT3) ; port eMMC_QSPI.SD3_DATA3
SD3_DATA4: U3.B3(DAT4) ; port eMMC_QSPI.SD3_DATA4
SD3_DATA5: U3.B4(DAT5) ; port eMMC_QSPI.SD3_DATA5
SD3_DATA6: U3.B5(DAT6) ; port eMMC_QSPI.SD3_DATA6
SD3_DATA7: U3.B6(DAT7) ; port eMMC_QSPI.SD3_DATA7
SD3_STROBE: TP25.1 U3.H5(RCLK) ; port eMMC_QSPI.SD3_STROBE
NetTP28_1: TP28.1 U3.K5(~{RST})

Not connected (* = marked no-connect by the designer): U3 A1(NC_A1)* A2(NC_A2)* A7(NC_A7)* A8(NC_A8)* A9(NC_A9)* A10(NC_A10)* A11(NC_A11)* A12(NC_A12)* A13(NC_A13)* A14(NC_A14)* B1(NC_B1)* B7(NC_B7)* B8(NC_B8)* B9(NC_B9)* B10(NC_B10)* B11(NC_B11)* B12(NC_B12)* B13(NC_B13)* B14(NC_B14)* C1(NC_C1)* C3(NC_C3)* C5(NC_C5)* C7(NC_C7)* C8(NC_C8)* C9(NC_C9)* C10(NC_C10)* C11(NC_C11)* C12(NC_C12)* C13(NC_C13)* C14(NC_C14)* D1(NC_D1)* D2(NC_D2)* D3(NC_D3)* D4(NC_D4)* D12(NC_D12)* D13(NC_D13)* D14(NC_D14)* E1(NC_E1)* E2(NC_E2)* E3(NC_E3)* E5(NC_E5)* E8(NC_E8)* E9(VSF1)* E10(VSF2)* E12(NC_E12)* E13(NC_E13)* E14(NC_E14)* F1(NC_F1)* F2(NC_F2)* F3(NC_F3)* F10(VSF3)* F12(NC_F12)* F13(NC_F13)* F14(NC_F14)* G1(NC_G1)* G2(NC_G2)* G3(NC_G3)* G10(NC_G10)* G12(NC_G12)* G13(NC_G13)* G14(NC_G14)* H1(NC_H1)* H2(NC_H2)* H3(NC_H3)* H12(NC_H12)* H13(NC_H13)* H14(NC_H14)* J1(NC_J1)* J2(NC_J2)* J3(NC_J3)* J12(NC_J12)* J13(NC_J13)* J14(NC_J14)* K1(NC_K1)* K2(NC_K2)* K3(NC_K3)* K6(NC_K6)* K7(NC_K7)* K10(VSF4)* K12(NC_K12)* K13(NC_K13)* K14(NC_K14)* L1(NC_L1)* L2(NC_L2)* L3(NC_L3)* L12(NC_L12)* L13(NC_L13)* L14(NC_L14)* M1(NC_M1)* M2(NC_M2)* M3(NC_M3)* M7(NC_M7)* M8(NC_M8)* M9(NC_M9)* M10(NC_M10)* M11(NC_M11)* M12(NC_M12)* M13(NC_M13)* M14(NC_M14)* N1(NC_N1)* N3(NC_N3)* N6(NC_N6)* N7(NC_N7)* N8(NC_N8)* N9(NC_N9)* N10(NC_N10)* N11(NC_N11)* N12(NC_N12)* N13(NC_N13)* N14(NC_N14)* P1(NC_P1)* P2(NC_P2)* P7(NC_P7)* P8(NC_P8)* P9(NC_P9)* P10(NC_P10)* P11(NC_P11)* P12(NC_P12)* P13(NC_P13)* P14(NC_P14)*

### Layout directives
net class eMMC: SD3_CLK, SD3_CMD, SD3_DATA0, SD3_DATA1, SD3_DATA2, SD3_DATA3, SD3_DATA4, SD3_DATA5, SD3_DATA6, SD3_DATA7, SD3_STROBE

### Notes on the sheet
- Storage
- eMMC5.1
- # 1.8V(Fixed)
- DNP
- (near R34) DNP
- Alternative Part:
- (near U3) 32GB
- SDINBDA6-32G-I           Western Digital
- EMMC32G-TB29-PZ90     Kingston
- PCB Des :
- Approv By :
- Project Title :
- Sheet Title :
- Date :
- PCB Version :
- Size :
- A3
- Page :
- PCB Revision :
- (in symbol IC_MEMORY_eMMC_SDINBDG4-32G-I1, part A) eMMC / 32GB

### Library data of the parts
C93 = CAP_4.7UF_10V_X5R_0402: Multilayer Ceramic Capacitor, 4.7 uF, 10 V, ± 10%, X5R, 0402 [1005 Metric]; Manufacturer: Samsung; Supplier 1: Digikey; Manufacturer Part Number: CL05A475KP5NRNC; RoHS: Yes; Category: Ceramic Capacitors; Stock 1: 748042; Pricing 1: 1=0.28, 10=0.184, 50=0.129, 100=0.1042, 500=0.0774, 1000=0.06772, 2500=0.0645, 5000=0.05966 (USD); Mount: Surface Mount; Case Code (Metric): 1005; Case Code (Imperial): 0402; Material: Ceramic; Min Operating Temperature: -55°C; Max Operating Temperature: 85°C; Tolerance: 10%; Packaging: Tape and Reel; Package Quantity: 1; Dielectric: X5R; Series: CL; Construction: Flat; Length: 1mm; Width: 0.02inch; Height: 0.5mm; Thickness: 0.022inch; Depth: 0.5mm; Radiation Hardening: No; RoHS Compliant: Yes; Lead Free: Lead Free; ComponentLink1URL: https://datasheet.ciiva.com/25724/cl05a475kp5nrnc-25724404.pdf?src-supplier=Digikey; ComponentLink1Description: https://datasheet.ciiva.com/25724/cl05a475kp5nrnc-25724404.pdf?src-supplier=Digikey; ComponentLink2URL: https://datasheet.ciiva.com/29198/458873-da-01-en-vs-kondensator-0402-29198304.pdf?src-supplier=Conrad; ComponentLink2Description: https://datasheet.ciiva.com/29198/458873-da-01-en-vs-kondensator-0402-29198304.pdf?src-supplier=Conrad; Supplier Part Number 1: 1276-1480-1-ND
C94 C95 C97-C100 = CAP_0.22UF_10V_X5R_0201: Multilayer Ceramic Capacitors (High dielectric type), 10V, 0.22 uF, ± 20 %, 0201, X5R, RoHS; Manufacturer: Taiyo Yuden; Material: 4241ConductorMaterial; Tolerance: 20%; Supplier 1: Digikey; Manufacturer Part Number: LMK063BJ224MP-F; RoHS: Yes; Category: Ceramic Capacitors; Stock 1: 6053224; Pricing 1: 1=0.12, 10=0.08, 50=0.0478, 100=0.0375, 500=0.02772, 1000=0.02295, 2500=0.02136, 5000=0.01954 (USD); Mount: Surface Mount; Case Code (Metric): 0603; Case Code (Imperial): 0201; Min Operating Temperature: -55°C; Max Operating Temperature: 85°C; Voltage Rating: 10V; Packaging: Tape and Reel; Package Quantity: 15000; Dielectric: X5R; Termination: SMD/SMT; Voltage: 10V; Series: M; Construction: Flat; Length: 0.6mm; Width: 0.3mm; Height: 0.3mm; Depth: 0.3mm; Radiation Hardening: No; Halogen Free: Halogen Free; RoHS Compliant: Yes; Reach SVHC Compliant: Unknown; ComponentLink1URL: https://datasheet.ciiva.com/134/lmk063bj224mp-f-ss-134995.pdf?src-supplier=Digikey; ComponentLink1Description: https://datasheet.ciiva.com/134/lmk063bj224mp-f-ss-134995.pdf?src-supplier=Digikey; ComponentLink2URL: https://datasheet.ciiva.com/11464/lmk063bj224mp-f-ss-11464053.pdf?src-supplier=Avnet; ComponentLink2Description: https://datasheet.ciiva.com/11464/lmk063bj224mp-f-ss-11464053.pdf?src-supplier=Avnet; ComponentLink3URL: https://datasheet.ciiva.com/15921/1589lmk063bj224mp-f-15921250.pdf?src-supplier=Onlinecomponents.com; ComponentLink3Description: https://datasheet.ciiva.com/15921/1589lmk063bj224mp-f-15921250.pdf?src-supplier=Onlinecomponents.com; ComponentLink4URL: https://datasheet.ciiva.com/26872/getdatasheetpartid-639019-26872592.pdf?src-supplier=Verical; ComponentLink4Description: https://datasheet.ciiva.com/26872/getdatasheetpartid-639019-26872592.pdf?src-supplier=Verical; ComponentLink5URL: https://datasheet.ciiva.com/30243/100lmk063bj224mp-f-30243150.pdf?src-supplier=Onlinecomponents.com; ComponentLink5Description: https://datasheet.ciiva.com/30243/100lmk063bj224mp-f-30243150.pdf?src-supplier=Onlinecomponents.com; ComponentLink6URL: https://datasheet.ciiva.com/28645/746258-28645141.pdf?src-supplier=Element14; ComponentLink6Description: https://datasheet.ciiva.com/28645/746258-28645141.pdf?src-supplier=Element14; ComponentLink7URL: https://datasheet.ciiva.com/5422/mlcc-all-e-541559-5422365.pdf?src-supplier=Mouser; ComponentLink7Description: https://datasheet.ciiva.com/5422/mlcc-all-e-541559-5422365.pdf?src-supplier=Mouser; Supplier Part Number 1: 587-2483-1-ND
C96 = CAP_10UF_6.3V_X5R_0402: Cap Ceramic 10uF 6.3V X5R 20% SMD 0402 85C T/R; Manufacturer: Samsung; Supplier 1: Digikey; Manufacturer Part Number: CL05A106MQ5NUNC; RoHS: Yes; Category: Ceramic Capacitors; Stock 1: 6097180; Pricing 1: 1=0.24, 10=0.153, 50=0.0968, 100=0.0774, 500=0.05588, 1000=0.04943, 2500=0.04728, 5000=0.04299 (USD); Mount: Surface Mount; Case Code (Metric): 1005; Case Code (Imperial): 0402; Min Operating Temperature: -55°C; Max Operating Temperature: 85°C; Packaging: Tape and Reel; Tolerance: 20%; Dielectric: X5R; Series: CL; Package Quantity: 1; Construction: Flat; Length: 1mm; Width: 0.02inch; Height: 0.5mm; Depth: 0.5mm; Thickness: 0.028inch; Radiation Hardening: No; RoHS Compliant: Yes; ComponentLink1URL: https://datasheet.ciiva.com/16437/cl05a106mq5nunc-16437356.pdf?src-supplier=Future+Electronics; ComponentLink1Description: https://datasheet.ciiva.com/16437/cl05a106mq5nunc-16437356.pdf?src-supplier=Future+Electronics; ComponentLink2URL: https://datasheet.ciiva.com/26877/getdatasheetpartid-355289-26877841.pdf?src-supplier=Verical; ComponentLink2Description: https://datasheet.ciiva.com/26877/getdatasheetpartid-355289-26877841.pdf?src-supplier=Verical; Supplier Part Number 1: 1276-1451-1-ND
C101 = CAP_1UF_6.3V_X5R_0201: 0201 1 uF 6.3 V ±20 % Tolerance X5R Surface Mount Multilayer Ceramic Capacitor; Manufacturer: Kyocera AVX; Tolerance: 20%; Supplier 1: Mouser; Manufacturer Part Number: 02016D105MAT2A; RoHS: Yes; Category: Ceramic Capacitors; Stock 1: 1026413; Pricing 1: 1=0.1, 10=0.028, 50=0.028, 100=0.014, 1000=0.008, 10000=0.006 (USD); Mount: Surface Mount; Number of Pins: 2; Case Code (Metric): 0603; Case Code (Imperial): 0201; Min Operating Temperature: -55°C; Max Operating Temperature: 85°C; Packaging: Cut Tape; Series: -; Voltage Rating: 6.3V; Package Quantity: 1; Length: 0.024inch; Width: 0.012inch; Thickness: 0.013inch; Depth: 0.3mm; Lead Free: Lead Free; RoHS Compliant: Yes; Reach SVHC Compliant: No; ComponentLink1URL: https://datasheet.ciiva.com/6265/cx5r-6265595.pdf?src-supplier=Digi-Key; ComponentLink1Description: https://datasheet.ciiva.com/6265/cx5r-6265595.pdf?src-supplier=Digi-Key; ComponentLink2URL: https://datasheet.ciiva.com/1123/1666675-1123122.pdf?src-supplier=Element14; ComponentLink2Description: https://datasheet.ciiva.com/1123/1666675-1123122.pdf?src-supplier=Element14; ComponentLink3URL: https://datasheet.ciiva.com/14891/cx5r-14891029.pdf?src-supplier=Digi-Key; ComponentLink3Description: https://datasheet.ciiva.com/14891/cx5r-14891029.pdf?src-supplier=Digi-Key; ComponentLink4URL: https://datasheet.ciiva.com/7614/cx5r-7614682.pdf?src-supplier=Digi-Key; ComponentLink4Description: https://datasheet.ciiva.com/7614/cx5r-7614682.pdf?src-supplier=Digi-Key; ComponentLink5URL: https://datasheet.ciiva.com/14891/cx5r-14891030.pdf?src-supplier=Digi-Key; ComponentLink5Description: https://datasheet.ciiva.com/14891/cx5r-14891030.pdf?src-supplier=Digi-Key; Supplier Part Number 1: 581-02016D105MAT2A; Dielectric: X5R
R33 R34 = RES_10K_1/12W_1%_0201: SMD Chip Resistor, 10 kOhm, ± 1%, 50 mW, 0201 [0603 Metric], Thick Film, General Purpose; Manufacturer: Yageo; Temperature Coefficient: 200ppm/°C; Power Rating: 50mW; Voltage Rating: 25V; Supplier 1: Digikey; Manufacturer Part Number: RC0201FR-0710KL; RoHS: Yes; Category: Chip SMD Resistors; Stock 1: 12030325; Pricing 1: 1=0.1, 10=0.027, 50=0.0172, 100=0.0143, 500=0.00988, 1000=0.00854, 5000=0.00629 (USD); Case/Package: 0201; Number of Pins: 2NUMBER; Contact Plating: Tin,Matte; Case Code (Metric): 0603; Weight: 6E-06oz; Min Operating Temperature: -55°C; Max Operating Temperature: 125°C; Packaging: Tape and Reel; Package Quantity: 10000; Termination: SMD/SMT; Resistor Type: Thick Film; Series: RC; Number of Terminations: 2; Max Power Dissipation: 50mW; Working Voltage: 25V; Features: Moisture Resistant; Technology: THICK FILM; Resistance Tolerance: 1%; Construction: Rectangular; Voltage Rating (DC): 25V; Length: 0.6mm; Width: 0.012inch; Height: 0.01inch; Depth: 0.3mm; RoHS Compliant: Yes; Reach SVHC Compliant: No; Military Standard: Not; Lead Free: 5697LeadFree; ComponentLink1URL: https://datasheet.ciiva.com/7660/1421516-7660807.pdf?src-supplier=Element14; ComponentLink1Description: https://datasheet.ciiva.com/7660/1421516-7660807.pdf?src-supplier=Element14; ComponentLink2URL: https://datasheet.ciiva.com/46391/1421516-46391339.pdf?src-supplier=Element14; ComponentLink2Description: https://datasheet.ciiva.com/46391/1421516-46391339.pdf?src-supplier=Element14; ComponentLink3URL: https://datasheet.ciiva.com/2467/pyu-r-int-thick-7-2467110.pdf?src-supplier=Digikey; ComponentLink3Description: https://datasheet.ciiva.com/2467/pyu-r-int-thick-7-2467110.pdf?src-supplier=Digikey; ComponentLink4URL: https://datasheet.ciiva.com/2467/pyu-r-int-thick-7-2467111.pdf?src-supplier=Digikey; ComponentLink4Description: https://datasheet.ciiva.com/2467/pyu-r-int-thick-7-2467111.pdf?src-supplier=Digikey; ComponentLink5URL: https://datasheet.ciiva.com/2467/pyu-r-int-thick-7-2467109.pdf?src-supplier=Digikey; ComponentLink5Description: https://datasheet.ciiva.com/2467/pyu-r-int-thick-7-2467109.pdf?src-supplier=Digikey; ComponentLink6URL: https://datasheet.ciiva.com/26829/getdatasheetpartid-421074-26829851.pdf?src-supplier=Verical; ComponentLink6Description: https://datasheet.ciiva.com/26829/getdatasheetpartid-421074-26829851.pdf?src-supplier=Verical; ComponentLink7URL: https://datasheet.ciiva.com/8891/pyu-rc0201-51-rohs-l-8-8891384.pdf?src-supplier=Avnet; ComponentLink7Description: https://datasheet.ciiva.com/8891/pyu-rc0201-51-rohs-l-8-8891384.pdf?src-supplier=Avnet; Supplier Part Number 1: 311-10.0KMCT-ND
TP24-TP28 = TP_PAD_SMD_SMALL: Test Point, SMD pad, round, 1.5mm, 1.6mm, 3mm diameter
U3 = IC_MEMORY_eMMC_SDINBDG4-32G-I1: Inand 7250 32GB Industrial Wide Temp -25C+85C EMMC5.1 HS400; Manufacturer: SanDisk; Supplier 1: Mouser; Manufacturer Part Number: SDINBDG4-32G-I1; RoHS: No; Category: Uncategorized; Stock 1: 1018; Pricing 1: 1=26.46, 10=24.64, 50=23.78, 100=20.87, 1000=20.16, 10000=20.16 (USD); RoHS Compliant: No; Supplier Part Number 1: 467-SDINBDG4-32G-I1

## Sheet PERIPHERALS.SchDoc: CONNECTOR A
size A2; DrawnBy: UKAYACIK; Engineer: UKAYACIK; DocumentNumber: 12; Revision: B; SheetNumber: 14; SheetTotal: 21
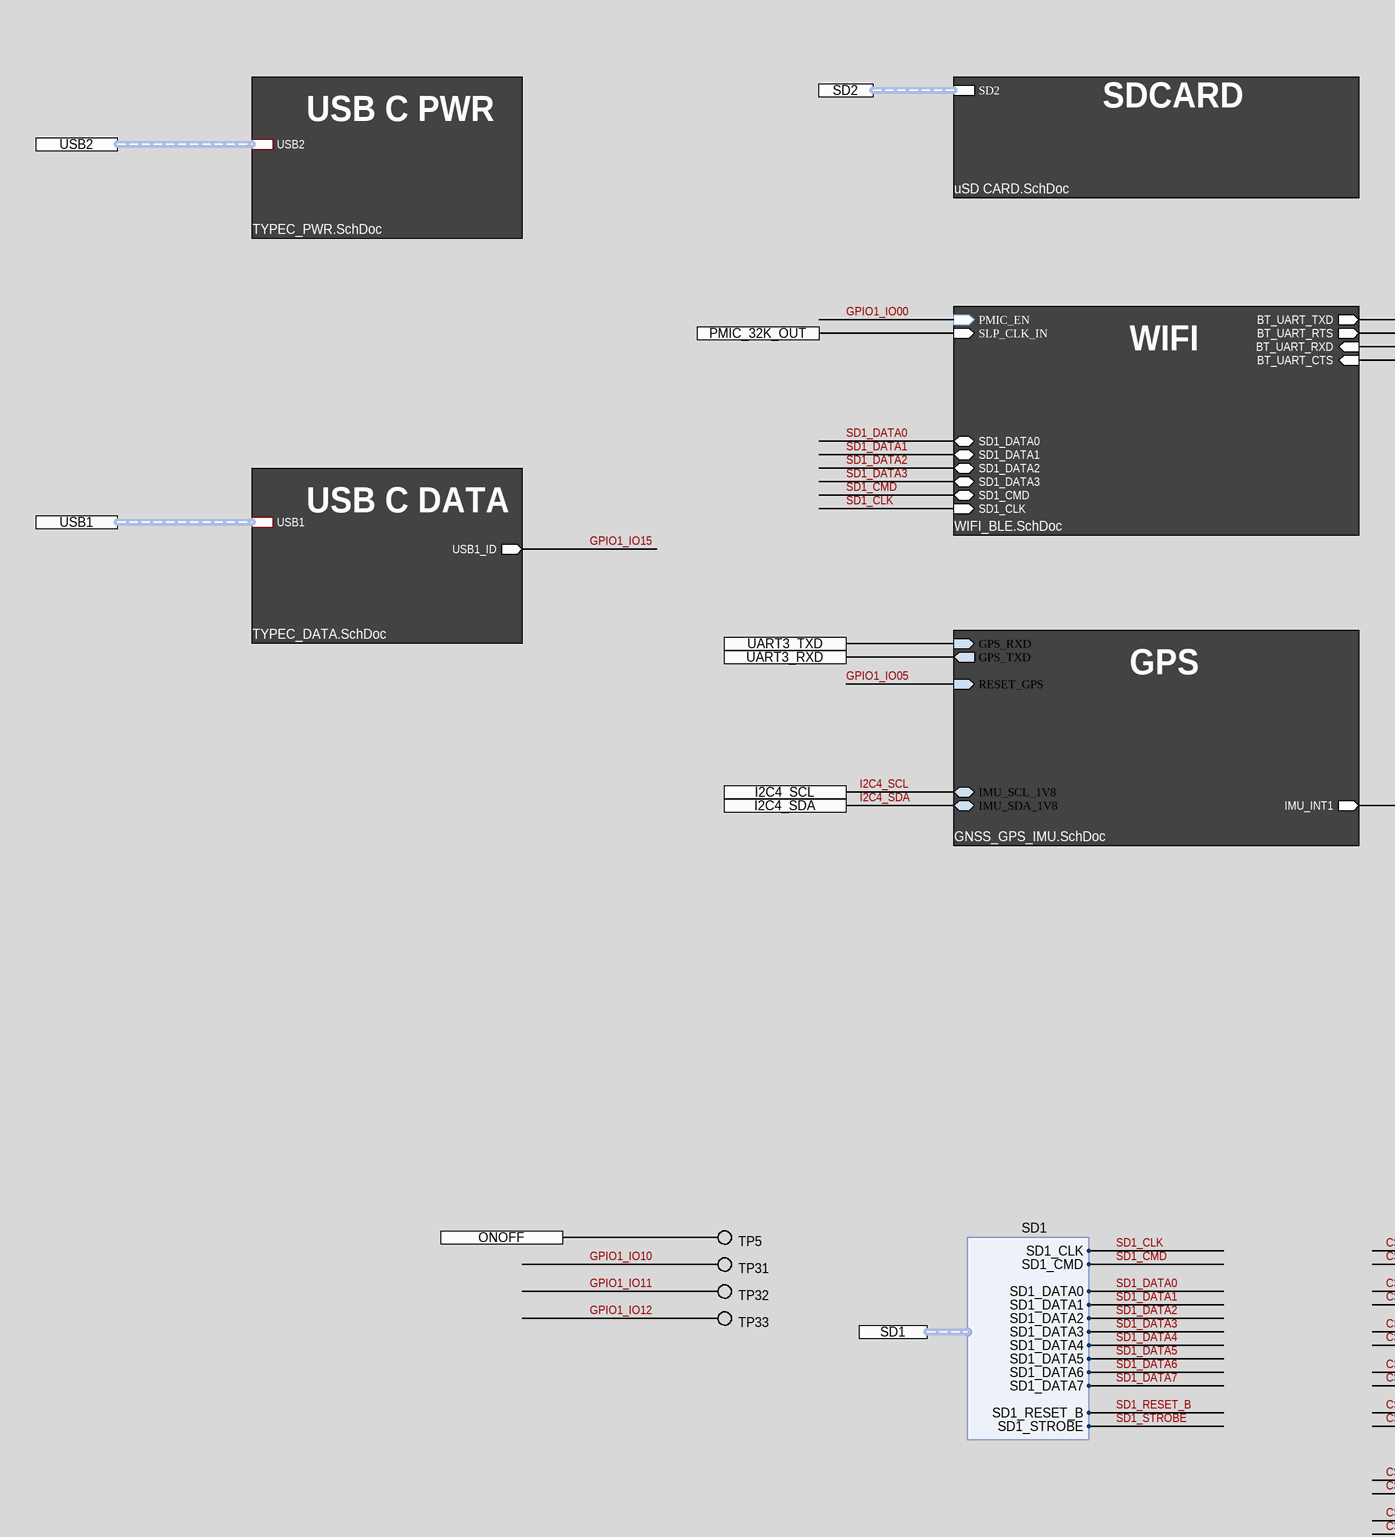
[diagram p14: PERIPHERALS.SchDoc, left]
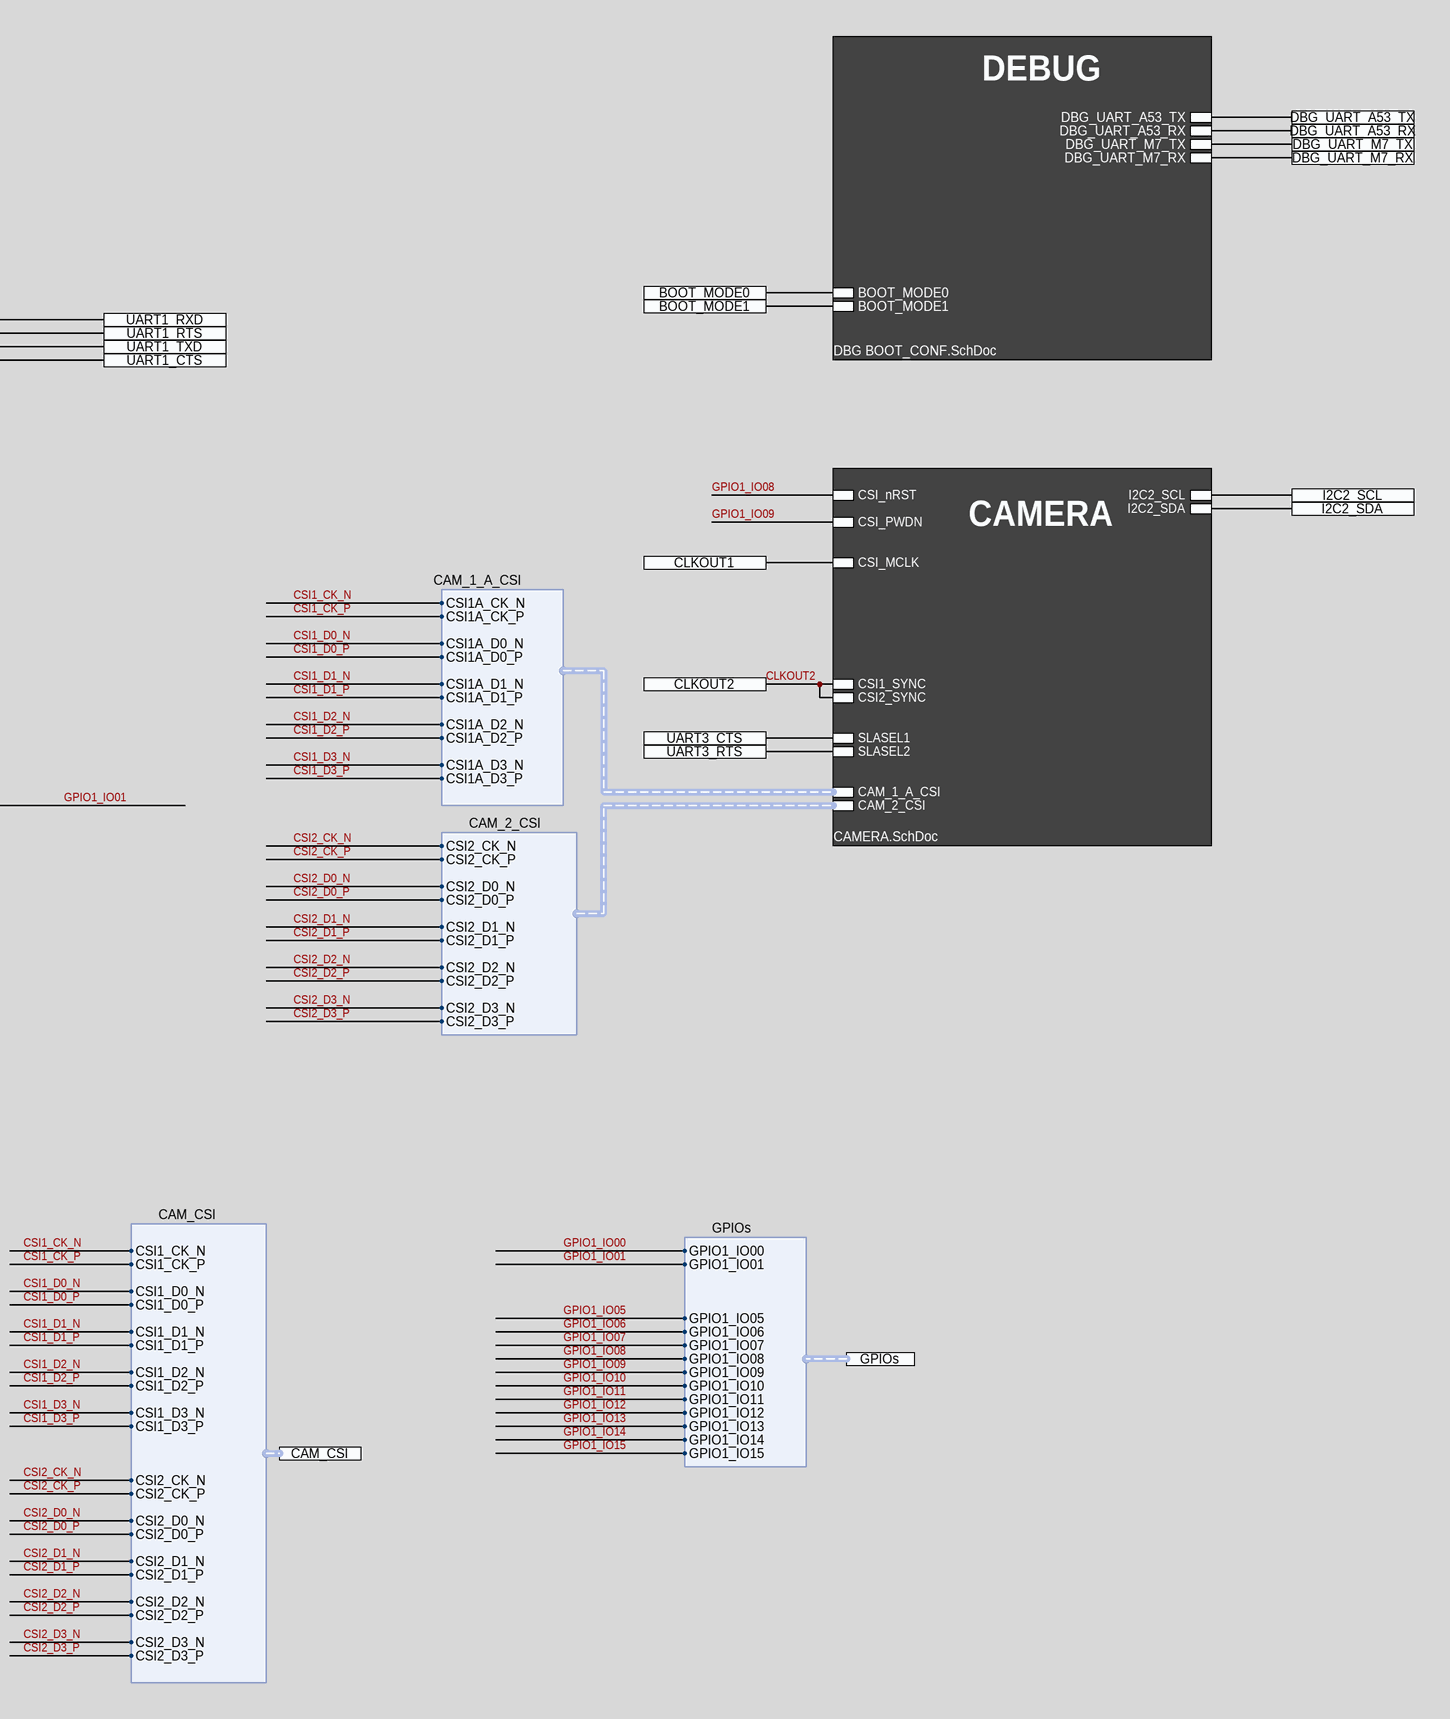
[diagram p15: PERIPHERALS.SchDoc, right]

### Parts
TP5  NO COMPONENT  [TP_PAD_0.5MM_SMD_ROUND]  (value not drawn)  (no BOM)
TP31  NO COMPONENT  [TP_PAD_0.5MM_SMD_ROUND]  (value not drawn)  (no BOM)
TP32  NO COMPONENT  [TP_PAD_0.5MM_SMD_ROUND]  (value not drawn)  (no BOM)
TP33  NO COMPONENT  [TP_PAD_0.5MM_SMD_ROUND]  (value not drawn)  (no BOM)

### Sub-sheets
Designator = TYPEC_PWR.SchDoc: USB2 (harness USB1)
Designator = TYPEC_DATA.SchDoc: USB1 (harness USB1), USB1_ID (out)
U_CAMERA = CAMERA.SchDoc: CSI_PWDN, CSI1_SYNC, CSI_MCLK, CSI_nRST, I2C2_SDA, I2C2_SCL, SLASEL1, CSI2_SYNC, SLASEL2, CAM_2_CSI (harness CAM_2_CSI), CAM_1_A_CSI (harness CAM_1_A_CSI)
U_DBG BOOT_CONF = DBG BOOT_CONF.SchDoc: DBG_UART_A53_TX, DBG_UART_A53_RX, DBG_UART_M7_RX, DBG_UART_M7_TX, BOOT_MODE0, BOOT_MODE1
U_GNSS_GPS_IMU = GNSS_GPS_IMU.SchDoc: IMU_SCL_1V8 (bidir), IMU_SDA_1V8 (bidir), IMU_INT1 (out), GPS_TXD (out), GPS_RXD (in), RESET_GPS (in)
U_uSD CARD = uSD CARD.SchDoc: SD2 (harness SD2)
U_WIFI_BLE = WIFI_BLE.SchDoc: PMIC_EN (in), SLP_CLK_IN (in), SD1_DATA0 (bidir), SD1_DATA1 (bidir), SD1_DATA2 (bidir), SD1_DATA3 (bidir), SD1_CMD (bidir), SD1_CLK (in), BT_UART_CTS (in), BT_UART_RXD (in), BT_UART_TXD (out), BT_UART_RTS (out)

### Ports
BOOT_MODE0, BOOT_MODE1, CAM_CSI (harness CAM_CSI), CLKOUT1, CLKOUT2, DBG_UART_A53_RX, DBG_UART_A53_TX, DBG_UART_M7_RX, DBG_UART_M7_TX, GPIOs (harness GPIOs), I2C2_SCL, I2C2_SDA, I2C4_SCL, I2C4_SDA, ONOFF, PMIC_32K_OUT, SD1 (harness SD1), SD2 (harness SD2), UART1_CTS, UART1_RTS, UART1_RXD, UART1_TXD, UART3_CTS, UART3_RTS, UART3_RXD, UART3_TXD, USB1 (harness USB1), USB2 (harness USB2)

### Harnesses
SD1: SD1_CMD, SD1_DATA0, SD1_DATA1, SD1_DATA2, SD1_DATA3, SD1_DATA4, SD1_DATA6, SD1_DATA7, SD1_RESET_B, SD1_STROBE, SD1_CLK, SD1_DATA5
CAM_CSI: CSI1_CK_N, CSI1_CK_P, CSI1_D0_N, CSI1_D0_P, CSI1_D1_N, CSI1_D1_P, CSI1_D2_N, CSI1_D2_P, CSI1_D3_N, CSI1_D3_P, CSI2_CK_N, CSI2_CK_P, CSI2_D0_N, CSI2_D0_P, CSI2_D1_N, CSI2_D1_P, CSI2_D2_N, CSI2_D2_P, CSI2_D3_N, CSI2_D3_P
GPIOs: GPIO1_IO00, GPIO1_IO01, GPIO1_IO05, GPIO1_IO06, GPIO1_IO07, GPIO1_IO08, GPIO1_IO09, GPIO1_IO10, GPIO1_IO11, GPIO1_IO12, GPIO1_IO13, GPIO1_IO14, GPIO1_IO15
CAM_2_CSI: CSI2_CK_N, CSI2_CK_P, CSI2_D0_N, CSI2_D0_P, CSI2_D1_N, CSI2_D1_P, CSI2_D2_N, CSI2_D2_P, CSI2_D3_N, CSI2_D3_P
CAM_1_A_CSI: CSI1A_CK_N, CSI1A_CK_P, CSI1A_D0_N, CSI1A_D0_P, CSI1A_D1_N, CSI1A_D1_P, CSI1A_D2_N, CSI1A_D2_P, CSI1A_D3_N, CSI1A_D3_P

### Nets
BOOT_MODE0: port BOOT_MODE0, sheet U_DBG BOOT_CONF/BOOT_MODE0
BOOT_MODE1: port BOOT_MODE1, sheet U_DBG BOOT_CONF/BOOT_MODE1
BT_UART_CTS: port UART1_CTS, sheet U_WIFI_BLE/BT_UART_CTS
BT_UART_RTS: port UART1_RTS, sheet U_WIFI_BLE/BT_UART_RTS
BT_UART_RXD: port UART1_TXD, sheet U_WIFI_BLE/BT_UART_RXD
BT_UART_TXD: port UART1_RXD, sheet U_WIFI_BLE/BT_UART_TXD
CLKOUT2: port CLKOUT2, sheet U_CAMERA/CSI1_SYNC, sheet U_CAMERA/CSI2_SYNC
CSI1_CK_N: port CAM_CSI.CSI1_CK_N, sheet U_CAMERA/CAM_1_A_CSI.CSI1A_CK_N
CSI1_CK_P: port CAM_CSI.CSI1_CK_P, sheet U_CAMERA/CAM_1_A_CSI.CSI1A_CK_P
CSI1_D0_N: port CAM_CSI.CSI1_D0_N, sheet U_CAMERA/CAM_1_A_CSI.CSI1A_D0_N
CSI1_D0_P: port CAM_CSI.CSI1_D0_P, sheet U_CAMERA/CAM_1_A_CSI.CSI1A_D0_P
CSI1_D1_N: port CAM_CSI.CSI1_D1_N, sheet U_CAMERA/CAM_1_A_CSI.CSI1A_D1_N
CSI1_D1_P: port CAM_CSI.CSI1_D1_P, sheet U_CAMERA/CAM_1_A_CSI.CSI1A_D1_P
CSI1_D2_N: port CAM_CSI.CSI1_D2_N, sheet U_CAMERA/CAM_1_A_CSI.CSI1A_D2_N
CSI1_D2_P: port CAM_CSI.CSI1_D2_P, sheet U_CAMERA/CAM_1_A_CSI.CSI1A_D2_P
CSI1_D3_N: port CAM_CSI.CSI1_D3_N, sheet U_CAMERA/CAM_1_A_CSI.CSI1A_D3_N
CSI1_D3_P: port CAM_CSI.CSI1_D3_P, sheet U_CAMERA/CAM_1_A_CSI.CSI1A_D3_P
CSI2_CK_N: port CAM_CSI.CSI2_CK_N, sheet U_CAMERA/CAM_2_CSI.CSI2_CK_N
CSI2_CK_P: port CAM_CSI.CSI2_CK_P, sheet U_CAMERA/CAM_2_CSI.CSI2_CK_P
CSI2_D0_N: port CAM_CSI.CSI2_D0_N, sheet U_CAMERA/CAM_2_CSI.CSI2_D0_N
CSI2_D0_P: port CAM_CSI.CSI2_D0_P, sheet U_CAMERA/CAM_2_CSI.CSI2_D0_P
CSI2_D1_N: port CAM_CSI.CSI2_D1_N, sheet U_CAMERA/CAM_2_CSI.CSI2_D1_N
CSI2_D1_P: port CAM_CSI.CSI2_D1_P, sheet U_CAMERA/CAM_2_CSI.CSI2_D1_P
CSI2_D2_N: port CAM_CSI.CSI2_D2_N, sheet U_CAMERA/CAM_2_CSI.CSI2_D2_N
CSI2_D2_P: port CAM_CSI.CSI2_D2_P, sheet U_CAMERA/CAM_2_CSI.CSI2_D2_P
CSI2_D3_N: port CAM_CSI.CSI2_D3_N, sheet U_CAMERA/CAM_2_CSI.CSI2_D3_N
CSI2_D3_P: port CAM_CSI.CSI2_D3_P, sheet U_CAMERA/CAM_2_CSI.CSI2_D3_P
CSI_MCLK_R: port CLKOUT1, sheet U_CAMERA/CSI_MCLK
DBG_UART_A53_RX: port DBG_UART_A53_RX, sheet U_DBG BOOT_CONF/DBG_UART_A53_RX
DBG_UART_A53_TX: port DBG_UART_A53_TX, sheet U_DBG BOOT_CONF/DBG_UART_A53_TX
DBG_UART_M7_RX: port DBG_UART_M7_RX, sheet U_DBG BOOT_CONF/DBG_UART_M7_RX
DBG_UART_M7_TX: port DBG_UART_M7_TX, sheet U_DBG BOOT_CONF/DBG_UART_M7_TX
GPIO1_IO00: sheet U_WIFI_BLE/PMIC_EN, port GPIOs.GPIO1_IO00
GPIO1_IO01: sheet U_GNSS_GPS_IMU/IMU_INT1, port GPIOs.GPIO1_IO01
GPIO1_IO05: sheet U_GNSS_GPS_IMU/RESET_GPS, port GPIOs.GPIO1_IO05
GPIO1_IO06: port GPIOs.GPIO1_IO06
GPIO1_IO07: port GPIOs.GPIO1_IO07
GPIO1_IO08: sheet U_CAMERA/CSI_nRST, port GPIOs.GPIO1_IO08  [project net CSI_nRST_R]
GPIO1_IO09: sheet U_CAMERA/CSI_PWDN, port GPIOs.GPIO1_IO09  [project net CSI_PWDN_R]
GPIO1_IO10: TP31.1 ; port GPIOs.GPIO1_IO10
GPIO1_IO11: TP32.1 ; port GPIOs.GPIO1_IO11
GPIO1_IO12: TP33.1 ; port GPIOs.GPIO1_IO12
GPIO1_IO13: port GPIOs.GPIO1_IO13
GPIO1_IO14: port GPIOs.GPIO1_IO14
GPIO1_IO15: sheet Designator/USB1_ID, port GPIOs.GPIO1_IO15
GPS_RXD: port UART3_TXD, sheet U_GNSS_GPS_IMU/GPS_RXD
GPS_TXD: port UART3_RXD, sheet U_GNSS_GPS_IMU/GPS_TXD
I2C2_SCL_R: port I2C2_SCL, sheet U_CAMERA/I2C2_SCL
I2C2_SDA_R: port I2C2_SDA, sheet U_CAMERA/I2C2_SDA
I2C4_SCL: port I2C4_SCL, sheet U_GNSS_GPS_IMU/IMU_SCL_1V8
I2C4_SDA: port I2C4_SDA, sheet U_GNSS_GPS_IMU/IMU_SDA_1V8
ONOFF: TP5.1 ; port ONOFF
SD1_CLK: sheet U_WIFI_BLE/SD1_CLK, port SD1.SD1_CLK
SD1_CMD: sheet U_WIFI_BLE/SD1_CMD, port SD1.SD1_CMD
SD1_DATA0: sheet U_WIFI_BLE/SD1_DATA0, port SD1.SD1_DATA0
SD1_DATA1: sheet U_WIFI_BLE/SD1_DATA1, port SD1.SD1_DATA1
SD1_DATA2: sheet U_WIFI_BLE/SD1_DATA2, port SD1.SD1_DATA2
SD1_DATA3: sheet U_WIFI_BLE/SD1_DATA3, port SD1.SD1_DATA3
SD1_DATA4: port SD1.SD1_DATA4
SD1_DATA5: port SD1.SD1_DATA5
SD1_DATA6: port SD1.SD1_DATA6
SD1_DATA7: port SD1.SD1_DATA7
SD1_RESET_B: port SD1.SD1_RESET_B
SD1_STROBE: port SD1.SD1_STROBE
SLASEL1_R: port UART3_CTS, sheet U_CAMERA/SLASEL1
SLASEL2_R: port UART3_RTS, sheet U_CAMERA/SLASEL2
SLP_CLK_IN: port PMIC_32K_OUT, sheet U_WIFI_BLE/SLP_CLK_IN

### Buses and harness runs
harness port SD2 = sheet U_uSD CARD/SD2
harness port USB1 = sheet Designator/USB1
harness port USB2 = sheet Designator/USB2

### Notes on the sheet
- DEBUG
- USB C PWR
- SDCARD
- WIFI
- USB C DATA
- CAMERA
- GPS
- PCB Des :
- Approv By :
- Project Title :
- Sheet Title :
- Date :
- Page :
- PCB Version :
- PCB Revision :
- Size :
- A2

### Library data of the parts
TP5 TP31-TP33 = TP_PAD_SMD_SMALL: as TP24-TP28 on sheet eMMC FLASH